# Altium project Relay Controller REV4.PrjPcb
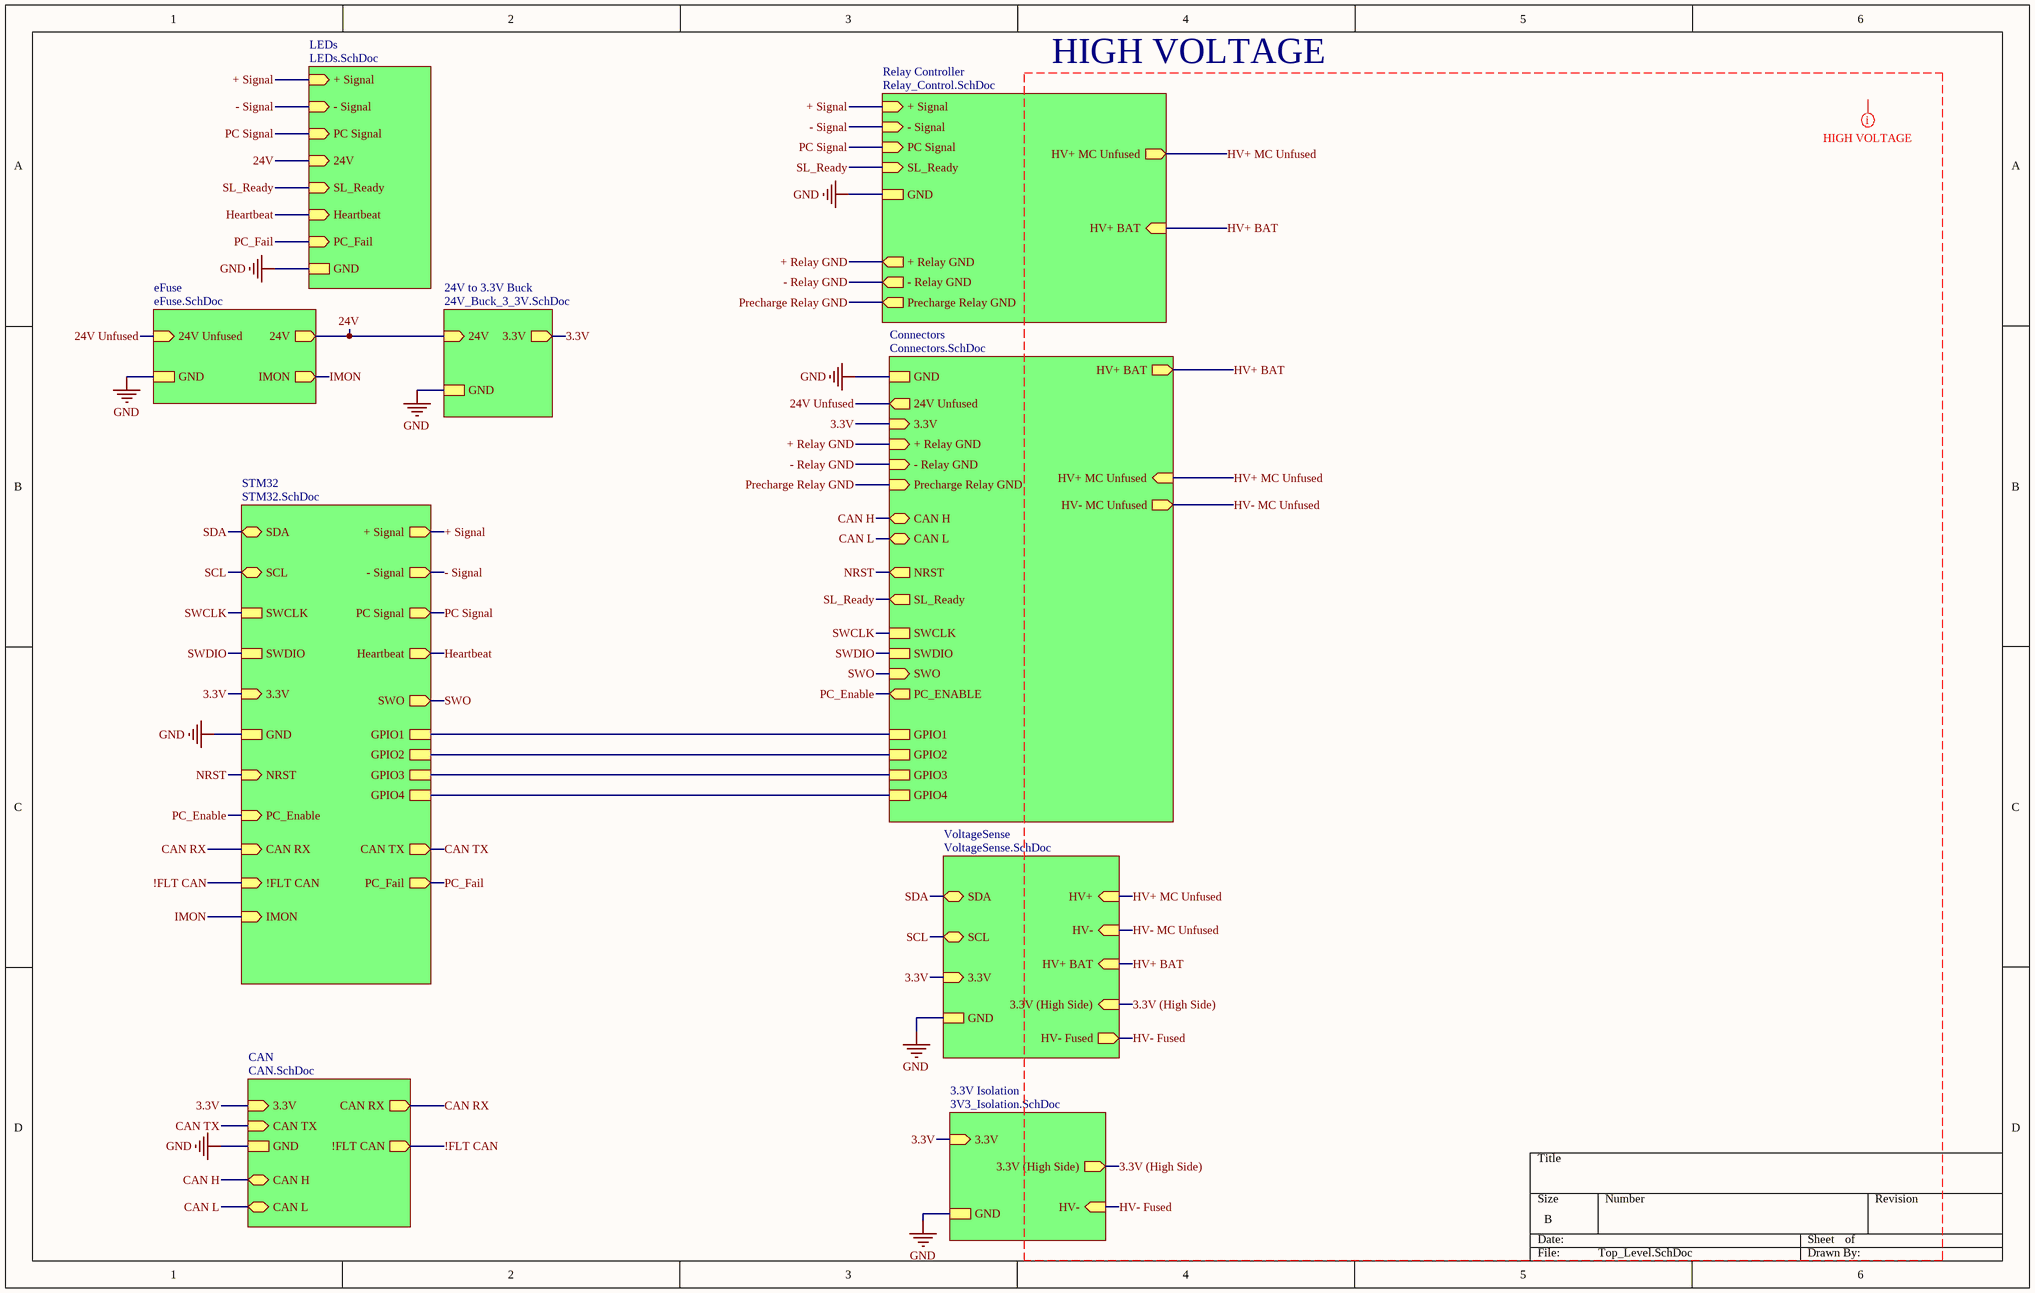
[diagram p0: Top_Level.SchDoc]
11 sheets, 129 parts. Net scope: hierarchical (ports join the sheet entries above them; power ports are global).
Board file: Relay_Controller_REV4.PcbDoc
Sheets:
  Top_Level.SchDoc
    Relay Controller = Relay_Control.SchDoc
    Connectors = Connectors.SchDoc
    LEDs = LEDs.SchDoc
      + = LED_Driver.SchDoc
      - = LED_Driver.SchDoc
      PC = LED_Driver.SchDoc
      HB = LED_Driver.SchDoc
      SLR = LED_Driver.SchDoc
      PC_Fail = Precharge_Fail.SchDoc
    STM32 = STM32.SchDoc
    VoltageSense = VoltageSense.SchDoc
    eFuse = eFuse.SchDoc
    24V to 3.3V Buck = 24V_Buck_3_3V.SchDoc
    CAN = CAN.SchDoc

## Sheet Top_Level.SchDoc
size B; SheetNumber: 1; SheetTotal: 10

### Sub-sheets
3.3V Isolation = 3V3_Isolation.SchDoc (file not in this document): GND, 3.3V (in), 3.3V (High Side) (out), HV- (in)
24V to 3.3V Buck = 24V_Buck_3_3V.SchDoc: 24V (in), GND, 3.3V (out)
CAN = CAN.SchDoc: 3.3V (in), GND, CAN RX (out), CAN TX (in), !FLT CAN (out), CAN H (bidir), CAN L (bidir)
Connectors = Connectors.SchDoc: GND, + Relay GND (in), - Relay GND (in), Precharge Relay GND (in), HV+ BAT (out), 24V Unfused (out), HV+ MC Unfused (in), HV- MC Unfused (out), 3.3V (in), SWCLK, SWDIO, SWO (in), NRST (out), GPIO1, GPIO2, GPIO3, GPIO4, PC_ENABLE (out), CAN H (bidir), CAN L (bidir), SL_Ready (out)
eFuse = eFuse.SchDoc: 24V Unfused (in), GND, 24V (out), IMON (out)
LEDs = LEDs.SchDoc: + Signal (in), - Signal (in), PC Signal (in), 24V (in), GND, SL_Ready (in), Heartbeat (in), PC_Fail (in)
Relay Controller = Relay_Control.SchDoc: + Signal (in), - Signal (in), PC Signal (in), SL_Ready (in), GND, + Relay GND (out), - Relay GND (out), Precharge Relay GND (out), HV+ MC Unfused (out), HV+ BAT (in)
STM32 = STM32.SchDoc: SDA (bidir), SCL (bidir), 3.3V (in), + Signal (out), - Signal (out), PC Signal (out), GND, SWCLK, SWDIO, SWO (out), NRST (in), GPIO1, GPIO2, GPIO3, GPIO4, PC_Enable (in), CAN TX (out), CAN RX (in), Heartbeat (out), !FLT CAN (in), IMON (in), PC_Fail (out)
VoltageSense = VoltageSense.SchDoc: HV+ (in), HV- (in), 3.3V (in), SDA (bidir), SCL (bidir), GND, 3.3V (High Side) (in), HV- Fused (out), HV+ BAT (in)

### Nets
GND: sheet Relay Controller/GND, sheet Connectors/GND, sheet LEDs/GND, sheet STM32/GND, sheet VoltageSense/GND, sheet eFuse/GND, sheet 24V to 3.3V Buck/GND, sheet 3.3V Isolation/GND, sheet CAN/GND
3.3V: sheet Connectors/3.3V, sheet STM32/3.3V, sheet VoltageSense/3.3V, sheet 24V to 3.3V Buck/3.3V, sheet 3.3V Isolation/3.3V, sheet CAN/3.3V
3.3V (High Side): sheet VoltageSense/3.3V (High Side), sheet 3.3V Isolation/3.3V (High Side)
24V: sheet LEDs/24V, sheet eFuse/24V, sheet 24V to 3.3V Buck/24V
24V Unfused: sheet Connectors/24V Unfused, sheet eFuse/24V Unfused
!FLT CAN: sheet STM32/!FLT CAN, sheet CAN/!FLT CAN
+ Relay GND: sheet Relay Controller/+ Relay GND, sheet Connectors/+ Relay GND
+ Signal: sheet Relay Controller/+ Signal, sheet LEDs/+ Signal, sheet STM32/+ Signal
- Relay GND: sheet Relay Controller/- Relay GND, sheet Connectors/- Relay GND
- Signal: sheet Relay Controller/- Signal, sheet LEDs/- Signal, sheet STM32/- Signal
CAN H: sheet Connectors/CAN H, sheet CAN/CAN H
CAN L: sheet Connectors/CAN L, sheet CAN/CAN L
CAN RX: sheet STM32/CAN RX, sheet CAN/CAN RX
CAN TX: sheet STM32/CAN TX, sheet CAN/CAN TX
Heartbeat: sheet LEDs/Heartbeat, sheet STM32/Heartbeat
HV+ BAT: sheet Relay Controller/HV+ BAT, sheet Connectors/HV+ BAT, sheet VoltageSense/HV+ BAT
HV+ MC Unfused: sheet Relay Controller/HV+ MC Unfused, sheet Connectors/HV+ MC Unfused, sheet VoltageSense/HV+
HV- Fused: sheet VoltageSense/HV- Fused, sheet 3.3V Isolation/HV-  [project net HV-]
HV- MC Unfused: sheet Connectors/HV- MC Unfused, sheet VoltageSense/HV-
IMON: sheet STM32/IMON, sheet eFuse/IMON
NRST: sheet Connectors/NRST, sheet STM32/NRST
PC Signal: sheet Relay Controller/PC Signal, sheet LEDs/PC Signal, sheet STM32/PC Signal
PC_Enable: sheet Connectors/PC_ENABLE, sheet STM32/PC_Enable
PC_Fail: sheet LEDs/PC_Fail, sheet STM32/PC_Fail
Precharge Relay GND: sheet Relay Controller/Precharge Relay GND, sheet Connectors/Precharge Relay GND
SCL: sheet STM32/SCL, sheet VoltageSense/SCL
SDA: sheet STM32/SDA, sheet VoltageSense/SDA
SL_Ready: sheet Relay Controller/SL_Ready, sheet Connectors/SL_Ready, sheet LEDs/SL_Ready
SWCLK: sheet Connectors/SWCLK, sheet STM32/SWCLK
SWDIO: sheet Connectors/SWDIO, sheet STM32/SWDIO
SWO: sheet Connectors/SWO, sheet STM32/SWO
NetIC3_21: sheet Connectors/GPIO1, sheet STM32/GPIO1
NetIC3_23: sheet Connectors/GPIO2, sheet STM32/GPIO2
NetIC3_25: sheet Connectors/GPIO3, sheet STM32/GPIO3
NetIC3_27: sheet Connectors/GPIO4, sheet STM32/GPIO4

### Layout directives
mark named HIGH VOLTAGE: 3.3V (High Side), HV+ BAT, HV+ MC Unfused, HV- Fused, HV- MC Unfused

### Notes on the sheet
- HIGH VOLTAGE

## Sheet Relay_Control.SchDoc
size A; SheetNumber: 4; SheetTotal: 10
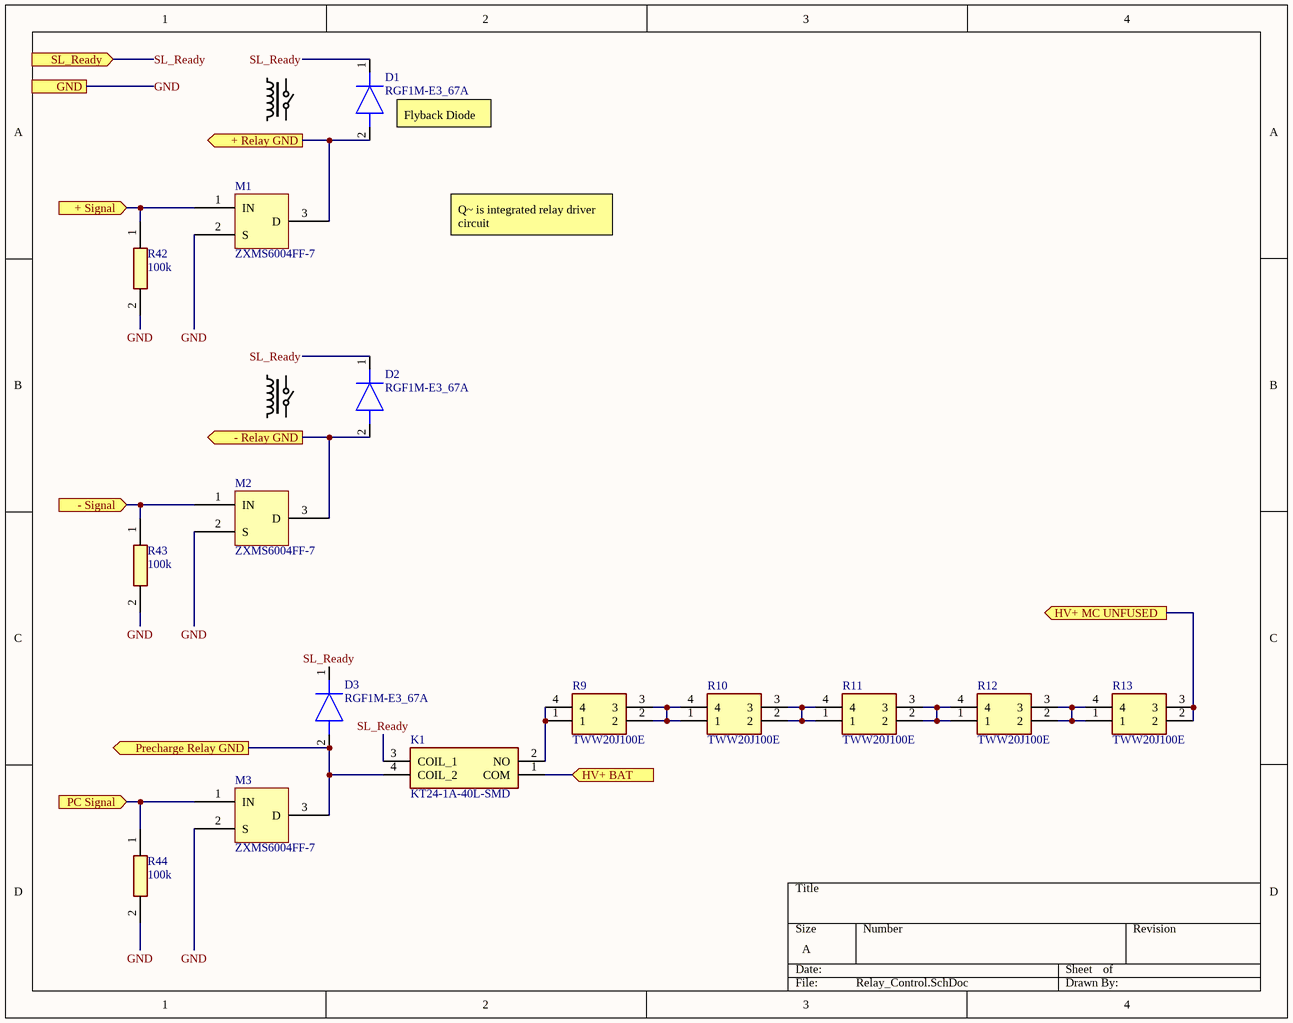
[diagram p1: Relay_Control.SchDoc]

### Parts
D1  RGF1M-E3_67A  [DIOM5426X300N]
D2  RGF1M-E3_67A  [DIOM5426X300N]
D3  RGF1M-E3_67A  [DIOM5426X300N]
K1  KT24-1A-40L-SMD  [KT241A40LSMD]
M1  ZXMS6004FF-7  [SOT95P240X100-3N]
M2  ZXMS6004FF-7  [SOT95P240X100-3N]
M3  ZXMS6004FF-7  [SOT95P240X100-3N]
R9  TWW20J100E  [TWW20J100E]
R10  TWW20J100E  [TWW20J100E]
R11  TWW20J100E  [TWW20J100E]
R12  TWW20J100E  [TWW20J100E]
R13  TWW20J100E  [TWW20J100E]
R42  100k  [RESC3216X65N]
R43  100k  [RESC3216X65N]
R44  100k  [RESC3216X65N]

### Ports
+ Relay GND (out), + Signal (in), - Relay GND (out), - Signal (in), GND, HV+ BAT (in), HV+ MC UNFUSED (out), PC Signal (in), Precharge Relay GND (out), SL_Ready (in)

### Nets
GND: M1.2(S) M2.2(S) M3.2(S) R42.2 R43.2 R44.2 ; port GND
+ Relay GND: D1.2(A) M1.3(D) ; port + Relay GND
+ Signal: M1.1(IN) R42.1 ; port + Signal
- Relay GND: D2.2(A) M2.3(D) ; port - Relay GND
- Signal: M2.1(IN) R43.1 ; port - Signal
HV+ BAT: K1.1(COM) ; port HV+ BAT
HV+ MC Unfused: R13.2 R13.3 ; port HV+ MC UNFUSED
PC Signal: M3.1(IN) R44.1 ; port PC Signal
Precharge Relay GND: D3.2(A) K1.4(COIL_2) M3.3(D) ; port Precharge Relay GND
SL_Ready: D1.1(K) D2.1(K) D3.1(K) K1.3(COIL_1) ; port SL_Ready
NetK1_2: K1.2(NO) R9.1 R9.4
NetR9_2: R9.2 R9.3 R10.1 R10.4
NetR10_2: R10.2 R10.3 R11.1 R11.4
NetR11_2: R11.2 R11.3 R12.1 R12.4
NetR12_2: R12.2 R12.3 R13.1 R13.4

### Notes on the sheet
- (near D1) Flyback Diode
- Q~ is integrated relay driver circuit

### Library data of the parts
D1-D3 = RGF1M-E3_67A: Diode; Manufacturer_Name: Vishay; Manufacturer_Part_Number: RGF1M-E3/67A; Datasheet Link: https://www.vishay.com/docs/88697/rgf1.pdf; Height: 3mm; Mouser Part Number: 625-RGF1M-E3; Mouser Price/Stock: https://www.mouser.co.uk/ProductDetail/Vishay-General-Semiconductor/RGF1M-E3-67A?qs=4xyK702%2F%252BQ1dl%252BTCdyIThg%3D%3D; Arrow Part Number: RGF1M-E3/67A; Arrow Price/Stock: https://www.arrow.com/en/products/rgf1m-e367a/vishay?region=nac
K1 = KT24-1A-40L-SMD: Relay or Contactor; Manufacturer_Name: Meder; Datasheet Link: https://www.mouser.de/datasheet/2/262/9024185401e-1633625.pdf; Height: 8.7mm; Manufacturer_Part_Number: KT24-1A-40L-SMD; Mouser Part Number: 876-KT24-1A-40L-SMD; Mouser Price/Stock: https://www.mouser.co.uk/ProductDetail/MEDER-electronic-Standex/KT24-1A-40L-SMD?qs=mUCnLpxNPte72XvEBELL9g%3D%3D
R9-R13 = TWW20J100E: Resistor; Manufacturer_Name: Ohmite; Datasheet Link: https://www.mouser.in/datasheet/2/303/res_tww_twm-1228653.pdf; Height: 46mm; Manufacturer_Part_Number: TWW20J100E; Mouser Part Number: 588-TWW20J100E; Mouser Price/Stock: https://www.mouser.co.uk/ProductDetail/Ohmite/TWW20J100E?qs=PzGy0jfpSMsE3rbWfgqD2A%3D%3D
R42-R44 = MCA1206ME1003BP500: Resistor; Manufacturer_Name: Vishay; Datasheet Link: https://www.vishay.com/docs/28700/mcx0x0xpre.pdf; Height: 0.65mm; Manufacturer_Part_Number: MCA1206ME1003BP500

## Sheet Connectors.SchDoc
size A; SheetNumber: 8; SheetTotal: 10
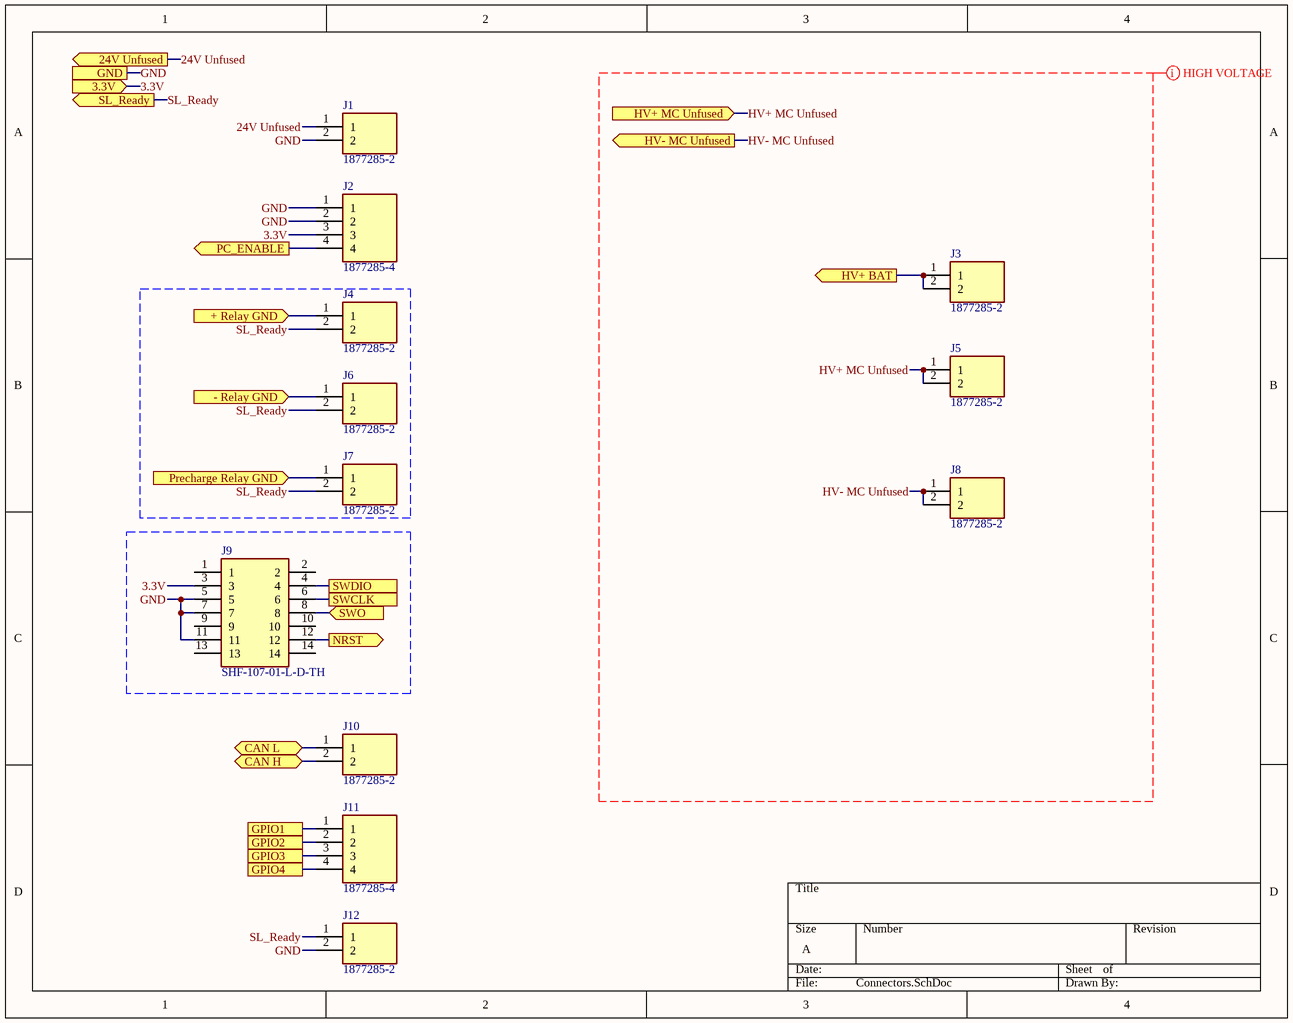
[diagram p2: Connectors.SchDoc]

### Parts
J1  1877285-2  [18772852]
J2  1877285-4  [18772854]
J3  1877285-2  [18772852]
J4  1877285-2  [18772852]
J5  1877285-2  [18772852]
J6  1877285-2  [18772852]
J7  1877285-2  [18772852]
J8  1877285-2  [18772852]
J9  SHF-107-01-L-D-TH  [SHF10701LDTH]
J10  1877285-2  [18772852]
J11  1877285-4  [18772854]
J12  1877285-2  [18772852]

### Ports
3.3V (in), 24V Unfused (out), + Relay GND (in), - Relay GND (in), CAN H (bidir), CAN L (bidir), GND, GPIO1, GPIO2, GPIO3, GPIO4, HV+ BAT (out), HV+ MC Unfused (in), HV- MC Unfused (out), NRST (out), PC_ENABLE (out), Precharge Relay GND (in), SL_Ready (out), SWCLK, SWDIO, SWO (in)

### Nets
GND: J1.2 J2.1 J2.2 J9.5 J9.7 J9.11 J12.2 ; port GND
3.3V: J2.3 J9.3 ; port 3.3V
24V Unfused: J1.1 ; port 24V Unfused
+ Relay GND: J4.1 ; port + Relay GND
- Relay GND: J6.1 ; port - Relay GND
CAN H: J10.2 ; port CAN H
CAN L: J10.1 ; port CAN L
HV+ BAT: J3.1 J3.2 ; port HV+ BAT
HV+ MC Unfused: J5.1 J5.2 ; port HV+ MC Unfused
HV- MC Unfused: J8.1 J8.2 ; port HV- MC Unfused
NRST: J9.12 ; port NRST
PC_Enable: J2.4 ; port PC_ENABLE
Precharge Relay GND: J7.1 ; port Precharge Relay GND
SL_Ready: J4.2 J6.2 J7.2 J12.1 ; port SL_Ready
SWCLK: J9.6 ; port SWCLK
SWDIO: J9.4 ; port SWDIO
SWO: J9.8 ; port SWO
NetIC3_21: J11.1 ; port GPIO1
NetIC3_23: J11.2 ; port GPIO2
NetIC3_25: J11.3 ; port GPIO3
NetIC3_27: J11.4 ; port GPIO4

Not connected (* = marked no-connect by the designer): J9 1 2 9 10 13 14

### Layout directives
mark named HIGH VOLTAGE: HV+ MC Unfused, HV- MC Unfused

### Library data of the parts
J1 J3-J8 J10 J12 = 1877285-2: Connector; Manufacturer_Name: TE Connectivity; Datasheet Link: https://www.te.com/commerce/DocumentDelivery/DDEController?Action=srchrtrv&DocNm=7-1773458-5_ECONOMY_POWER_QRG&DocType=Data%20Sheet&DocLang=English&PartCntxt=1877285-2&DocFormat=pdf; Height: 12mm; Manufacturer_Part_Number: 1877285-2; Mouser Part Number: 571-1877285-2; Mouser Price/Stock: https://www.mouser.co.uk/ProductDetail/TE-Connectivity/1877285-2?qs=ka3zfMQDmFlAIZq5pDt5JA%3D%3D; Arrow Part Number: 1877285-2; Arrow Price/Stock: https://www.arrow.com/en/products/1877285-2/te-connectivity?region=europe
J2 J11 = 1877285-4: Connector; Manufacturer_Name: TE Connectivity; Datasheet Link: https://www.te.com/commerce/DocumentDelivery/DDEController?Action=srchrtrv&DocNm=1877285&DocType=Customer%20Drawing&DocLang=English&PartCntxt=1877285-4&DocFormat=pdf; Height: 12.5mm; Manufacturer_Part_Number: 1877285-4; Mouser Part Number: 571-1877285-4; Mouser Price/Stock: https://www.mouser.co.uk/ProductDetail/TE-Connectivity/1877285-4?qs=ka3zfMQDmFkZPBtotDIXvQ%3D%3D; Arrow Part Number: 1877285-4; Arrow Price/Stock: https://www.arrow.com/en/products/1877285-4/te-connectivity?region=nac
J9 = SHF-107-01-L-D-TH: Connector; Manufacturer_Name: SAMTEC; Datasheet Link: https://componentsearchengine.com/Datasheets/1/SHF-107-01-L-D-TH.pdf; Height: 5.33mm; Manufacturer_Part_Number: SHF-107-01-L-D-TH; Mouser Part Number: 200-SHF10701LDTH; Mouser Price/Stock: https://www.mouser.co.uk/ProductDetail/Samtec/SHF-107-01-L-D-TH?qs=%252BZP6%2F%252BtExtDrbekpOnhfag%3D%3D; Arrow Part Number: SHF-107-01-L-D-TH; Arrow Price/Stock: https://www.arrow.com/en/products/shf-107-01-l-d-th/samtec?utm_currency=USD&region=nac

## Sheet LEDs.SchDoc
size A; SheetNumber: 5; SheetTotal: 10
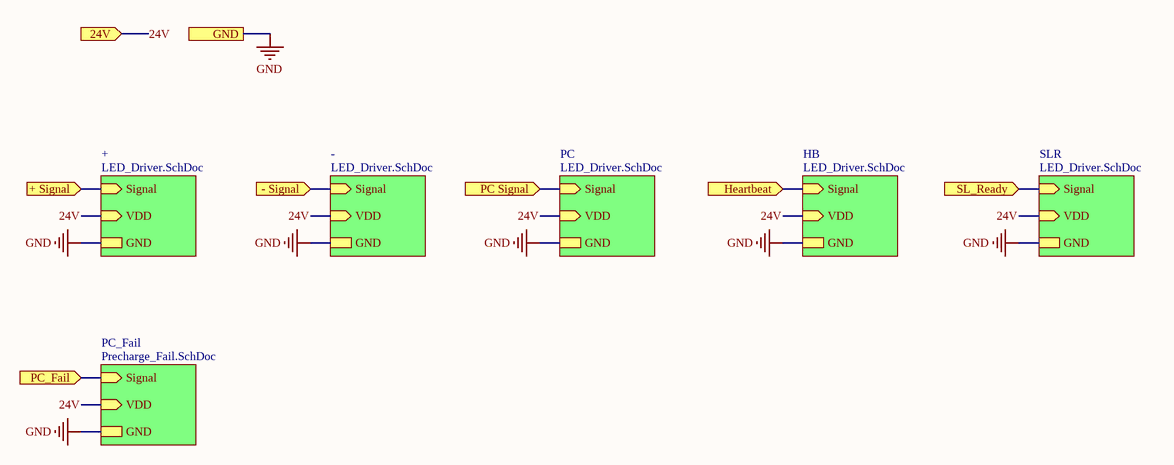
[diagram p3: LEDs.SchDoc]

### Sub-sheets
+ = LED_Driver.SchDoc: Signal (in), VDD (in), GND
- = LED_Driver.SchDoc: Signal (in), VDD (in), GND
HB = LED_Driver.SchDoc: Signal (in), VDD (in), GND
PC = LED_Driver.SchDoc: Signal (in), VDD (in), GND
PC_Fail = Precharge_Fail.SchDoc: Signal (in), VDD (in), GND
SLR = LED_Driver.SchDoc: Signal (in), VDD (in), GND

### Ports
24V (in), + Signal (in), - Signal (in), GND, Heartbeat (in), PC Signal (in), PC_Fail (in), SL_Ready (in)

### Nets
GND: port GND, sheet +/GND, sheet -/GND, sheet PC/GND, sheet HB/GND, sheet SLR/GND, sheet PC_Fail/GND
24V: port 24V, sheet +/VDD, sheet -/VDD, sheet PC/VDD, sheet HB/VDD, sheet SLR/VDD, sheet PC_Fail/VDD
+ Signal: port + Signal, sheet +/Signal
- Signal: port - Signal, sheet -/Signal
Heartbeat: port Heartbeat, sheet HB/Signal
PC Signal: port PC Signal, sheet PC/Signal
PC_Fail: port PC_Fail, sheet PC_Fail/Signal
SL_Ready: port SL_Ready, sheet SLR/Signal

## Sheet LED_Driver.SchDoc
size A; SheetNumber: 6; SheetTotal: 10
Used 5 times, as channels LEDs/+, LEDs/-, LEDs/PC, LEDs/HB, LEDs/SLR. Parts and nets are listed once, with the designators drawn on the sheet.
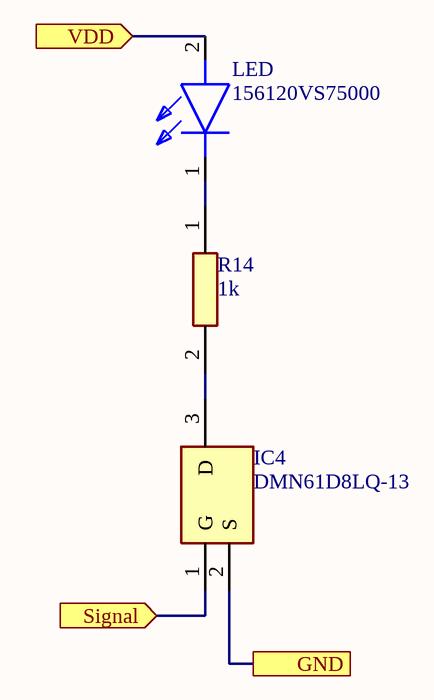
[diagram p4: LED_Driver.SchDoc]

### Parts
IC4  DMN61D8LQ-13  [SOT96P240X110-3N]
LED  156120VS75000  [156120VS75000]
R14  1k  [RESC3116X65N]

### Ports
GND, Signal (in), VDD (in)

### Nets
GND: IC4.2(S) ; port GND
Signal: IC4.1(G) ; port Signal
VDD: LED.2(A) ; port VDD
NetIC4_3: IC4.3(D) R14.2
NetLED_1: LED.1(K) R14.1

### Channels
LEDs/+: designators end in _+; ports GND=GND Signal=+ Signal VDD=24V
LEDs/-: designators end in _-; ports GND=GND Signal=- Signal VDD=24V
LEDs/PC: designators end in _PC; ports GND=GND Signal=PC Signal VDD=24V
LEDs/HB: designators end in _HB; ports GND=GND Signal=Heartbeat VDD=24V
LEDs/SLR: designators end in _SLR; ports GND=GND Signal=SL_Ready VDD=24V

### Library data of the parts
IC4 = DMN61D8LQ-13: Integrated Circuit; Manufacturer_Name: Diodes Incorporated; Datasheet Link: https://www.diodes.com//assets/Datasheets/DMN61D8LQ.pdf; Height: 1.1mm; Manufacturer_Part_Number: DMN61D8LQ-13; Mouser Part Number: 621-DMN61D8LQ-13; Mouser Price/Stock: https://www.mouser.co.uk/ProductDetail/Diodes-Incorporated/DMN61D8LQ-13?qs=DBvH5xl4UymJgoulTjiNCg%3D%3D; Arrow Part Number: DMN61D8LQ-13; Arrow Price/Stock: https://www.arrow.com/en/products/dmn61d8lq-13/diodes-incorporated?utm_currency=USD&region=nac
LED = 156120VS75000: LED; Manufacturer_Name: Wurth Elektronik; Datasheet Link: https://www.we-online.com/components/products/datasheet/156120VS75000.pdf; Height: 1.3mm; Manufacturer_Part_Number: 156120VS75000; Mouser Part Number: 710-156120VS75000; Mouser Price/Stock: https://www.mouser.co.uk/ProductDetail/Wurth-Elektronik/156120VS75000?qs=2kOmHSv6VfQAUFg5BeuEfQ%3D%3D
R14 = CRGS1206J1K0: Resistor; Manufacturer_Name: TE Connectivity; Datasheet Link: https://www.te.com/commerce/DocumentDelivery/DDEController?Action=srchrtrv&DocNm=9-1773463-8&DocType=Data%20Sheet&DocLang=English&PartCntxt=3-2176245-7&DocFormat=pdf; Height: 0.65mm; Manufacturer_Part_Number: CRGS1206J1K0; Mouser Part Number: 279-CRGS1206J1K0; Mouser Price/Stock: https://www.mouser.com/Search/Refine.aspx?Keyword=279-CRGS1206J1K0

## Sheet Precharge_Fail.SchDoc
size A
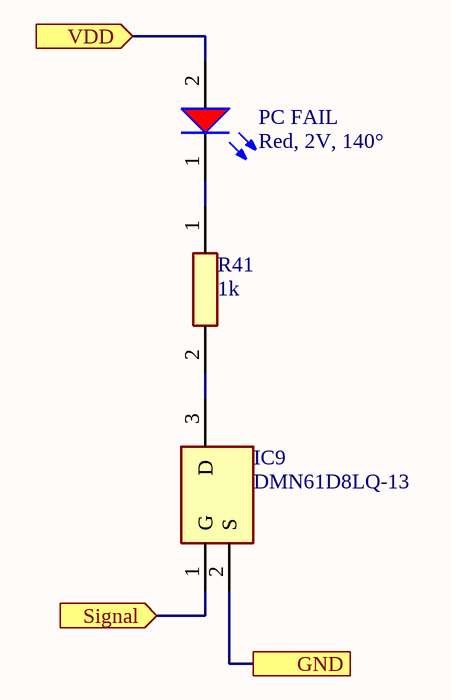
[diagram p5: Precharge_Fail.SchDoc]

### Parts
IC9  DMN61D8LQ-13  [SOT96P240X110-3N]
PC_FAIL  Red, 2V, 140°  [WL-SMRW_1206 rectangular_normal use]
R41  1k  [RESC3116X65N]

### Ports
GND, Signal (in), VDD (in)

### Nets
GND: IC9.2(S) ; port GND
24V: PC_FAIL.2(A) ; port VDD
PC_Fail: IC9.1(G) ; port Signal
NetIC9_3: IC9.3(D) R41.2
NetPC_FAIL_1: PC_FAIL.1(K) R41.1

### Library data of the parts
IC9 = DMN61D8LQ-13: as IC4 on sheet LED_Driver; Datasheet Link: https://www.diodes.com//assets/Datasheets/DMN61D8LQ.pdf; Height: 1.1mm; Manufacturer_Part_Number: DMN61D8LQ-13; Mouser Part Number: 621-DMN61D8LQ-13; Mouser Price/Stock: https://www.mouser.co.uk/ProductDetail/Diodes-Incorporated/DMN61D8LQ-13?qs=DBvH5xl4UymJgoulTjiNCg%3D%3D; Arrow Part Number: DMN61D8LQ-13; Arrow Price/Stock: https://www.arrow.com/en/products/dmn61d8lq-13/diodes-incorporated?utm_currency=USD&region=nac
PC_FAIL = 156120RS75000: WL-SMRW Mono-color Reverse mount Waterclear, SMT, size 1206 rectangular, Red, 2V, 140°; Manufacturer: Wurth Elektronik; Chip Technology: AlInGaP; Dominant Wavelength: 624nm; Luminous Intensity: 60mcd; Peak Wavelength: 632nm; Manufacturer Part Number: 156120RS75000; Category: Signal LEDs; Match Code: WL-SMRW; ComponentLink1Description: Website Link; ComponentLink1URL: https://www.we-online.com/redexpert/article/156120RS75000?ad; ComponentLink2Description: Datasheet Link; ComponentLink2URL: https://www.we-online.com/redexpert/spec/156120RS75000?ad; Mount: Surface Mount; Operating Temperature Max: 85°C; Operating Temperature Min: -40°C; Packaging: Tape and Reel; Case/Size Code: 1206 rectangular; Length: 3.2mm; Width: 1.6mm; Height: 1.2mm; Emitting Color: Red; Forward Voltage: 2V; Viewing Angle: 140°
R41 = CRGS1206J1K0: as R14 on sheet LED_Driver; Datasheet Link: https://www.te.com/commerce/DocumentDelivery/DDEController?Action=srchrtrv&DocNm=9-1773463-8&DocType=Data%20Sheet&DocLang=English&PartCntxt=3-2176245-7&DocFormat=pdf; Height: 0.65mm; Manufacturer_Part_Number: CRGS1206J1K0; Mouser Part Number: 279-CRGS1206J1K0; Mouser Price/Stock: https://www.mouser.com/Search/Refine.aspx?Keyword=279-CRGS1206J1K0

## Sheet STM32.SchDoc
size A; SheetNumber: 3; SheetTotal: 10
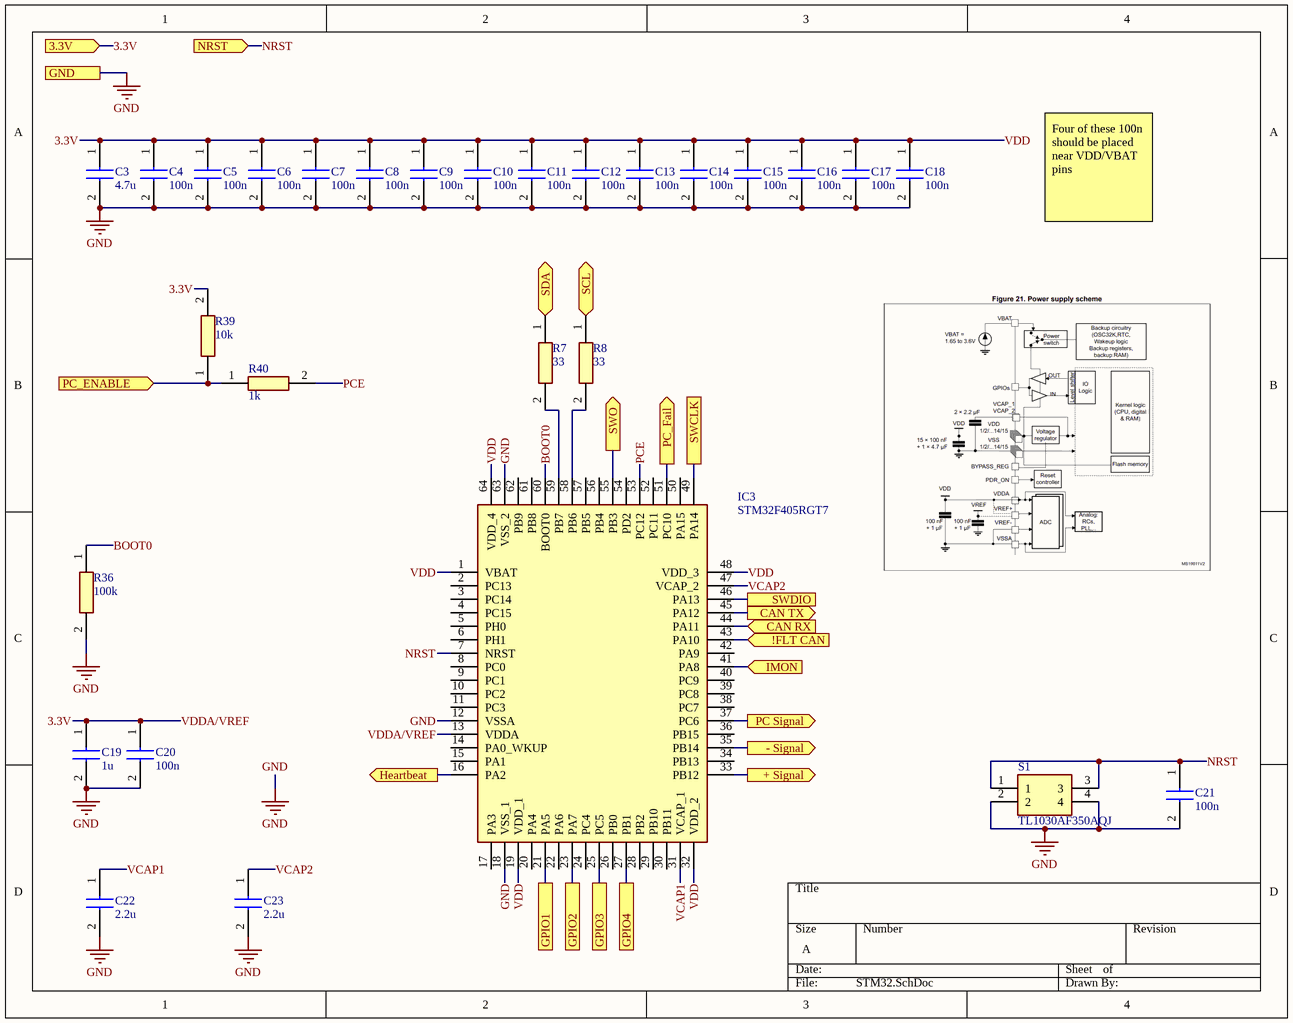
[diagram p6: STM32.SchDoc]

### Parts
C3  4.7u  [CAPC3216X180N]
C4  100n  [CAPC3216X94N]
C5  100n  [CAPC3216X94N]
C6  100n  [CAPC3216X94N]
C7  100n  [CAPC3216X94N]
C8  100n  [CAPC3216X94N]
C9  100n  [CAPC3216X94N]
C10  100n  [CAPC3216X94N]
C11  100n  [CAPC3216X94N]
C12  100n  [CAPC3216X94N]
C13  100n  [CAPC3216X94N]
C14  100n  [CAPC3216X94N]
C15  100n  [CAPC3216X94N]
C16  100n  [CAPC3216X94N]
C17  100n  [CAPC3216X94N]
C18  100n  [CAPC3216X94N]
C19  1u  [CAPC3216X180N]
C20  100n  [CAPC3216X94N]
C21  100n  [CAPC3216X94N]
C22  2.2u  [CAPC3216X180N]
C23  2.2u  [CAPC3216X180N]
IC3  STM32F405RGT7  [QFP50P1200X1200X160-64N]
R7  33  [ERJ8ENF1000V]
R8  33  [ERJ8ENF1000V]
R36  100k  [RESC3216X65N]
R39  10k  [RESC3216X65N]
R40  1k  [RESC3116X65N]
S1  TL1030AF350AQJ  [TL1030AF350AQJ]

### Ports
3.3V (in), !FLT CAN (in), + Signal (out), - Signal (out), CAN RX (in), CAN TX (out), GND, GPIO1, GPIO2, GPIO3, GPIO4, Heartbeat (out), IMON (in), NRST (in), PC Signal (out), PC_ENABLE (in), PC_Fail (out), SCL (bidir), SDA (bidir), SWCLK, SWDIO, SWO (out)

### Nets
GND: C3.2 C4.2 C5.2 C6.2 C7.2 C8.2 C9.2 C10.2 C11.2 C12.2 C13.2 C14.2 C15.2 C16.2 C17.2 C18.2 C19.2 C20.2 C21.2 C22.2 C23.2 IC3.12(VSSA) IC3.18(VSS_1) IC3.63(VSS_2) R36.2 S1.2 S1.4 ; port GND
3.3V: C3.1 C4.1 C5.1 C6.1 C7.1 C8.1 C9.1 C10.1 C11.1 C12.1 C13.1 C14.1 C15.1 C16.1 C17.1 C18.1 C19.1 C20.1 IC3.1(VBAT) IC3.13(VDDA) IC3.19(VDD_1) IC3.32(VDD_2) IC3.48(VDD_3) IC3.64(VDD_4) R39.2 ; port 3.3V  [also labelled VDD, VDDA/VREF]
!FLT CAN: IC3.43(PA10) ; port !FLT CAN
+ Signal: IC3.33(PB12) ; port + Signal
- Signal: IC3.35(PB14) ; port - Signal
BOOT0: IC3.60(BOOT0) R36.1
CAN RX: IC3.44(PA11) ; port CAN RX
CAN TX: IC3.45(PA12) ; port CAN TX
Heartbeat: IC3.16(PA2) ; port Heartbeat
IMON: IC3.41(PA8) ; port IMON
NRST: C21.1 IC3.7(NRST) S1.1 S1.3 ; port NRST
PC Signal: IC3.37(PC6) ; port PC Signal
PC_Enable: R39.1 R40.1 ; port PC_ENABLE
PC_Fail: IC3.51(PC10) ; port PC_Fail
PCE: IC3.53(PC12) R40.2
SCL: R8.1 ; port SCL
SDA: R7.1 ; port SDA
SWCLK: IC3.49(PA14) ; port SWCLK
SWDIO: IC3.46(PA13) ; port SWDIO
SWO: IC3.55(PB3) ; port SWO
VCAP1: C22.1 IC3.31(VCAP_1)
VCAP2: C23.1 IC3.47(VCAP_2)
NetIC3_21: IC3.21(PA5) ; port GPIO1
NetIC3_23: IC3.23(PA7) ; port GPIO2
NetIC3_25: IC3.25(PC5) ; port GPIO3
NetIC3_27: IC3.27(PB1) ; port GPIO4
NetIC3_58: IC3.58(PB6) R8.2
NetIC3_59: IC3.59(PB7) R7.2

Not connected (* = marked no-connect by the designer): IC3 2(PC13) 3(PC14) 4(PC15) 5(PH0) 6(PH1) 8(PC0) 9(PC1) 10(PC2) 11(PC3) 14(PA0_WKUP) 15(PA1) 17(PA3) 20(PA4) 22(PA6) 24(PC4) 26(PB0) 28(PB2) 29(PB10) 30(PB11) 34(PB13) 36(PB15) 38(PC7) 39(PC8) 40(PC9) 42(PA9) 50(PA15) 52(PC11) 54(PD2) 56(PB4) 57(PB5) 61(PB8) 62(PB9)

### Notes on the sheet
- Four of these 100n should be placed near VDD/VBAT pins

### Library data of the parts
C3 = GMK316AB7475KLHT: Capacitor; Manufacturer_Name: TAIYO YUDEN; Datasheet Link: https://ds.yuden.co.jp/TYCOMPAS/ap/specSheet?pn=MMASG31LAB7475KTNA01; Height: 1.8mm; Manufacturer_Part_Number: GMK316AB7475KLHT; Mouser Part Number: 963-GMK316AB7475KLHT; Mouser Price/Stock: https://www.mouser.co.uk/ProductDetail/TAIYO-YUDEN/GMK316AB7475KLHT?qs=CNQs48zzdnoeKLJ9%2F6WNWQ%3D%3D; Arrow Part Number: GMK316AB7475KLHT; Arrow Price/Stock: https://www.arrow.com/en/products/gmk316ab7475klht/taiyo-yuden?utm_currency=USD&region=nac
C4-C18 C20 C21 = 12065C104J4Z2A: Capacitor; Manufacturer_Name: Kyocera AVX; Datasheet Link: https://spicat.kyocera-avx.com/product/mlcc/chartview/12065C104J4Z2A/DataSheet/X7R; Height: 0.94mm; Manufacturer_Part_Number: 12065C104J4Z2A; Mouser Part Number: 581-12065C104J4Z2A; Mouser Price/Stock: https://www.mouser.com/Search/Refine.aspx?Keyword=581-12065C104J4Z2A
C19 = HMK316B7105KLHT: Capacitor; Manufacturer_Name: TAIYO YUDEN; Datasheet Link: https://mouser.componentsearchengine.com/Datasheets/1/HMK316B7105KLHT.pdf; Height: 1.8mm; Manufacturer_Part_Number: HMK316B7105KLHT; Mouser Part Number: 963-HMK316B7105KLHT; Mouser Price/Stock: https://www.mouser.co.uk/ProductDetail/TAIYO-YUDEN/HMK316B7105KLHT?qs=sz8xDBnIhcFmvpGfTAF0nQ%3D%3D; Arrow Part Number: HMK316B7105KLHT; Arrow Price/Stock: null?utm_currency=USD&region=nac
C22 C23 = CL31B225KCHSNNE: Capacitor; Manufacturer_Name: SAMSUNG; Datasheet Link: https://ms.componentsearchengine.com/Datasheets/2/CL31B225KCHSNNE.pdf; Height: 1.8mm; Manufacturer_Part_Number: CL31B225KCHSNNE; Mouser Part Number: 187-CL31B225KCHSNNE; Mouser Price/Stock: https://www.mouser.co.uk/ProductDetail/Samsung-Electro-Mechanics/CL31B225KCHSNNE?qs=EqekMjxHB%2FO4jGlN37Y2aA%3D%3D; Arrow Part Number: CL31B225KCHSNNE; Arrow Price/Stock: https://www.arrow.com/en/products/cl31b225kchsnne/samsung-electro-mechanics?utm_currency=USD&region=nac
IC3 = STM32F405RGT7: Integrated Circuit; Manufacturer_Name: STMicroelectronics; Datasheet Link: https://www.st.com/content/ccc/resource/technical/document/datasheet/ef/92/76/6d/bb/c2/4f/f7/DM00037051.pdf/files/DM00037051.pdf/jcr:content/translations/en.DM00037051.pdf; Height: 1.6mm; Manufacturer_Part_Number: STM32F405RGT7; Mouser Part Number: 511-STM32F405RGT7; Mouser Price/Stock: https://www.mouser.co.uk/ProductDetail/STMicroelectronics/STM32F405RGT7?qs=DqCdCwOw4%2F6rAq3yUvY8rA%3D%3D; Arrow Part Number: STM32F405RGT7; Arrow Price/Stock: https://www.arrow.com/en/products/stm32f405rgt7/stmicroelectronics?utm_currency=USD&region=nac
R7 R8 = ERJ-8ENF33R0V: Resistor; Manufacturer_Name: Panasonic; Datasheet Link: https://industrial.panasonic.com/cdbs/www-data/pdf/RDA0000/AOA0000C86.pdf; Height: 0.7mm; Manufacturer_Part_Number: ERJ-8ENF33R0V; Mouser Part Number: 667-ERJ-8ENF33R0V; Mouser Price/Stock: https://www.mouser.co.uk/ProductDetail/Panasonic/ERJ-8ENF33R0V?qs=8%252BG0TiN%2FgVpb1yH%2F8k6uQg%3D%3D
R36 = MCA1206ME1003BP500: Resistor; Manufacturer_Name: Vishay; Datasheet Link: https://www.vishay.com/docs/28700/mcx0x0xpre.pdf; Height: 0.65mm; Manufacturer_Part_Number: MCA1206ME1003BP500
R39 = SFR18EZPJ103: Resistor; Manufacturer_Name: ROHM Semiconductor; Datasheet Link: https://fscdn.rohm.com/en/products/databook/datasheet/passive/resistor/chip_resistor/sfr-e.pdf; Height: 0.65mm; Manufacturer_Part_Number: SFR18EZPJ103
R40 = CRGS1206J1K0: as R14 on sheet LED_Driver; Datasheet Link: https://www.te.com/commerce/DocumentDelivery/DDEController?Action=srchrtrv&DocNm=9-1773463-8&DocType=Data%20Sheet&DocLang=English&PartCntxt=3-2176245-7&DocFormat=pdf; Height: 0.65mm; Manufacturer_Part_Number: CRGS1206J1K0; Mouser Part Number: 279-CRGS1206J1K0; Mouser Price/Stock: https://www.mouser.com/Search/Refine.aspx?Keyword=279-CRGS1206J1K0
S1 = TL1030AF350AQJ: Switch; Manufacturer_Name: E-Switch; Datasheet Link: https://configured-product-images.s3.amazonaws.com/2D/specs/TL1030AF350AQJ.pdf; Height: 1.95mm; Manufacturer_Part_Number: TL1030AF350AQJ; Mouser Part Number: 612-TL1030AF350AQJ; Mouser Price/Stock: https://www.mouser.co.uk/ProductDetail/E-Switch/TL1030AF350AQJ?qs=VVKQmw408U%2FgalG8VZqjEg%3D%3D

## Sheet VoltageSense.SchDoc
size A; SheetNumber: 2; SheetTotal: 10
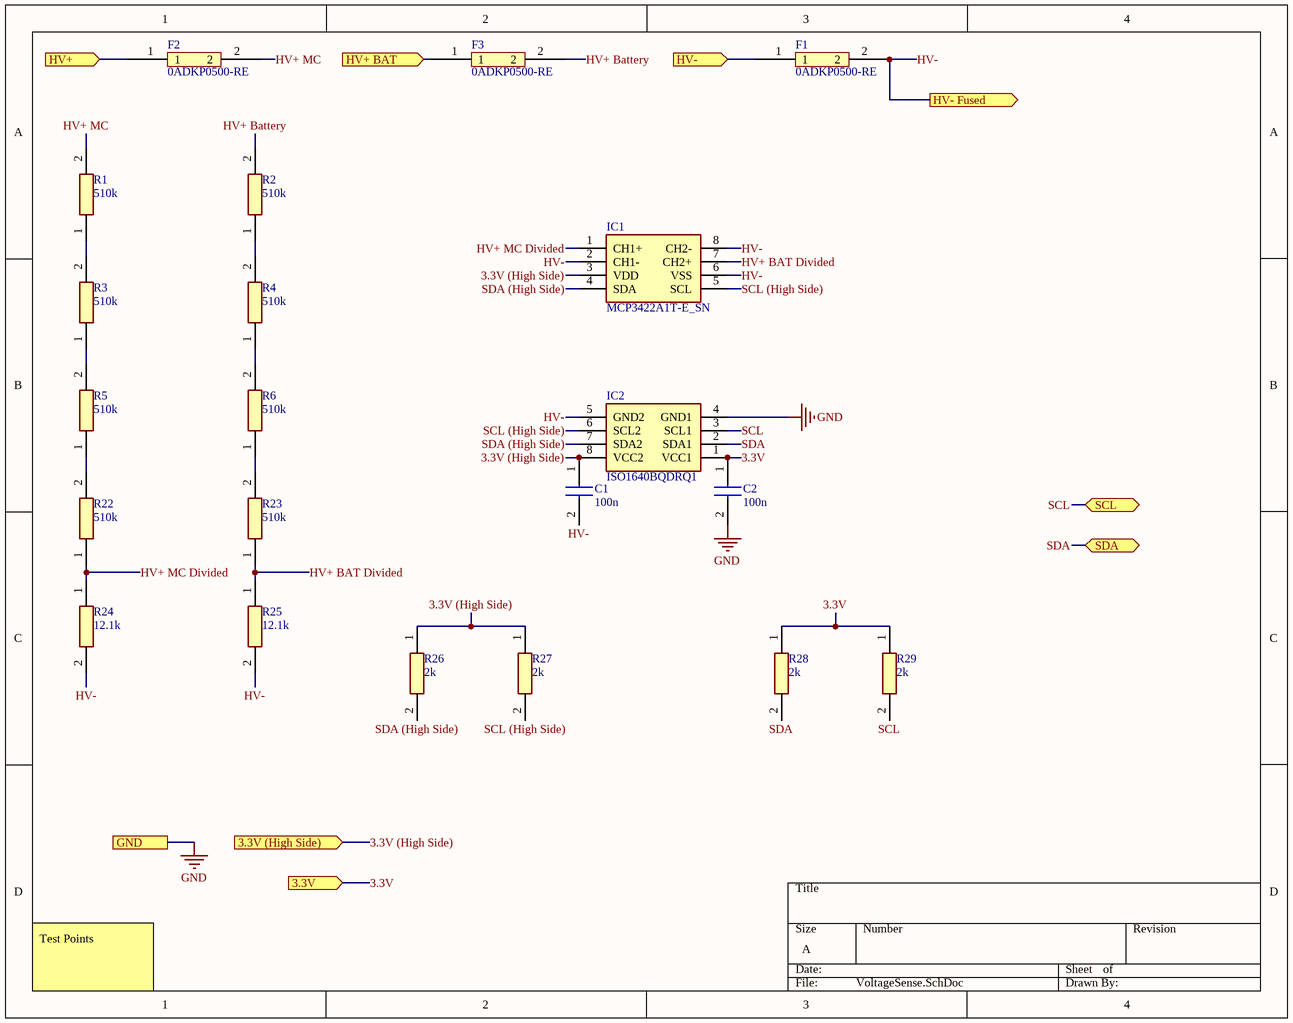
[diagram p7: VoltageSense.SchDoc]

### Parts
C1  100n  [CAPC3216X94N]
C2  100n  [CAPC3216X94N]
F1  0ADKP0500-RE  [0ADKP0500-RE]
F2  0ADKP0500-RE  [0ADKP0500-RE]
F3  0ADKP0500-RE  [0ADKP0500-RE]
IC1  MCP3422A1T-E_SN  [SOIC127P600X175-8N]
IC2  ISO1640BQDRQ1  [SOIC127P600X175-8N]
R1  510k  [RESC3216X75N]
R2  510k  [RESC3216X75N]
R3  510k  [RESC3216X75N]
R4  510k  [RESC3216X75N]
R5  510k  [RESC3216X75N]
R6  510k  [RESC3216X75N]
R22  510k  [RESC3216X75N]
R23  510k  [RESC3216X75N]
R24  12.1k  [ERA6AEB101V]
R25  12.1k  [ERA6AEB101V]
R26  2k  [RESC3116X65N]
R27  2k  [RESC3116X65N]
R28  2k  [RESC3116X65N]
R29  2k  [RESC3116X65N]

### Ports
3.3V (High Side) (in), 3.3V (in), GND, HV+ (in), HV+ BAT (in), HV- (in), HV- Fused (out), SCL (bidir), SDA (bidir)

### Nets
GND: C2.2 IC2.4(GND1) ; port GND
3.3V: C2.1 IC2.1(VCC1) R28.1 R29.1 ; port 3.3V
3.3V (High Side): C1.1 IC1.3(VDD) IC2.8(VCC2) R26.1 R27.1 ; port 3.3V (High Side)
HV+ BAT: F3.1 ; port HV+ BAT
HV+ BAT Divided: IC1.7(CH2+) R23.1 R25.1
HV+ Battery: F3.2 R2.2
HV+ MC: F2.2 R1.2
HV+ MC Divided: IC1.1(CH1+) R22.1 R24.1
HV+ MC Unfused: F2.1 ; port HV+
HV-: C1.2 F1.2 IC1.2(CH1-) IC1.6(VSS) IC1.8(CH2-) IC2.5(GND2) R24.2 R25.2 ; port HV- Fused
HV- MC Unfused: F1.1 ; port HV-
SCL: IC2.3(SCL1) R29.2 ; port SCL
SCL (High Side): IC1.5(SCL) IC2.6(SCL2) R27.2
SDA: IC2.2(SDA1) R28.2 ; port SDA
SDA (High Side): IC1.4(SDA) IC2.7(SDA2) R26.2
NetR1_1: R1.1 R3.2
NetR2_1: R2.1 R4.2
NetR3_1: R3.1 R5.2
NetR4_1: R4.1 R6.2
NetR5_1: R5.1 R22.2
NetR6_1: R6.1 R23.2

### Notes on the sheet
- Test Points

### Library data of the parts
C1 C2 = 12065C104J4Z2A: as C4 on sheet STM32; Datasheet Link: https://spicat.kyocera-avx.com/product/mlcc/chartview/12065C104J4Z2A/DataSheet/X7R; Height: 0.94mm; Manufacturer_Part_Number: 12065C104J4Z2A; Mouser Part Number: 581-12065C104J4Z2A; Mouser Price/Stock: https://www.mouser.com/Search/Refine.aspx?Keyword=581-12065C104J4Z2A
F1-F3 = 0ADKP0500-RE: Fuse
IC1 = MCP3422A1T-E_SN: Integrated Circuit; Manufacturer_Name: Microchip; Manufacturer_Part_Number: MCP3422A1T-E/SN; Datasheet Link: https://ww1.microchip.com/downloads/en/DeviceDoc/22088c.pdf; Height: 1.75mm; Mouser Part Number: 579-MCP3422A1T-E/SN; Mouser Price/Stock: https://www.mouser.co.uk/ProductDetail/Microchip-Technology/MCP3422A1T-E-SN?qs=X98pPdo4MrvBbe3HwfJ%252Bfw%3D%3D; Arrow Part Number: MCP3422A1T-E/SN; Arrow Price/Stock: https://www.arrow.com/en/products/mcp3422a1t-esn/microchip-technology
IC2 = ISO1640BQDRQ1: Integrated Circuit; Manufacturer_Name: Texas Instruments; Datasheet Link: https://www.ti.com/lit/ds/symlink/iso1640.pdf; Height: 1.75mm; Manufacturer_Part_Number: ISO1640BQDRQ1; Mouser Part Number: 595-ISO1640BQDRQ1; Mouser Price/Stock: https://www.mouser.co.uk/ProductDetail/Texas-Instruments/ISO1640BQDRQ1?qs=QNEnbhJQKvat3Z1mRPODGw%3D%3D; Arrow Part Number: ISO1640BQDRQ1; Arrow Price/Stock: https://www.arrow.com/en/products/iso1640bqdrq1/texas-instruments?region=nac
R1-R6 R22 R23 = CR1206-FX-5103ELF: Resistor; Manufacturer_Name: Bourns; Datasheet Link: http://componentsearchengine.com/Datasheets/1/CR1206-FX-5103ELF.pdf; Height: 0.75mm; Manufacturer_Part_Number: CR1206-FX-5103ELF; Mouser Part Number: 652-CR1206FX-5103ELF; Mouser Price/Stock: https://www.mouser.co.uk/ProductDetail/Bourns/CR1206-FX-5103ELF?qs=O4EQhShwvrpqwloF6Ll%2FVg%3D%3D; Arrow Part Number: CR1206-FX-5103ELF; Arrow Price/Stock: https://www.arrow.com/en/products/cr1206-fx-5103elf/bourns?region=europe
R24 R25 = ERA-6AEB1212V: Resistor; Manufacturer_Name: Panasonic; Datasheet Link: https://industrial.panasonic.com/cdbs/www-data/pdf/RDM0000/AOA0000C307.pdf; Height: 0.6mm; Manufacturer_Part_Number: ERA-6AEB1212V; Mouser Part Number: 667-ERA-6AEB1212V; Mouser Price/Stock: https://www.mouser.co.uk/ProductDetail/Panasonic/ERA-6AEB1212V?qs=DyUWGjl%252BcVvcV08sco2Dng%3D%3D
R26-R29 = CHP1206AFX-2001ELF: Resistor; Manufacturer_Name: Bourns; Datasheet Link: https://www.mouser.mx/datasheet/2/54/chp-a-1858677.pdf; Height: 0.65mm; Manufacturer_Part_Number: CHP1206AFX-2001ELF; Mouser Part Number: 652-CHP1206AFX-2001L; Mouser Price/Stock: https://www.mouser.co.uk/ProductDetail/Bourns/CHP1206AFX-2001ELF?qs=GedFDFLaBXERFI3Dnxqg6Q%3D%3D

## Sheet eFuse.SchDoc
size A; SheetNumber: 7; SheetTotal: 10
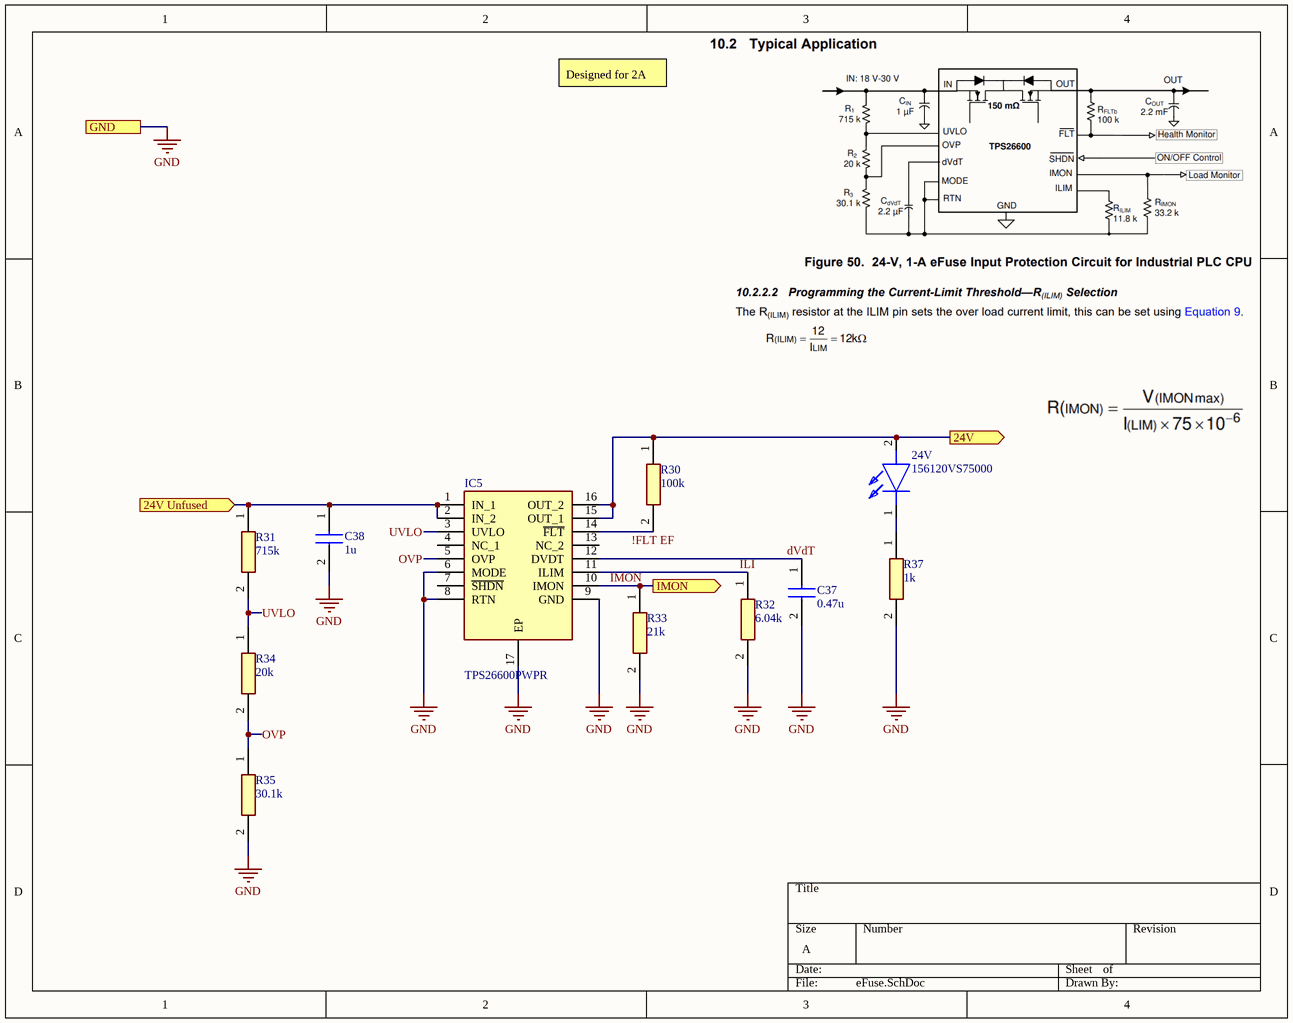
[diagram p8: eFuse.SchDoc]

### Parts
24V  156120VS75000  [156120VS75000]
C37  0.47u  [CAPC3216X152N]
C38  1u  [CAPC3216X178N]
IC5  TPS26600PWPR  [SOP65P640X120-17N]
R30  100k  [RESC3216X65N]
R31  715k  [RESC3216X70N]
R32  6.04k  [RESC3216X70N]
R33  21k  [RESC3216X70N]
R34  20k  [RESC3216X70N]
R35  30.1k  [RESC3216X70N]
R37  1k  [RESC3116X65N]

### Ports
24V (out), 24V Unfused (in), GND, IMON (out)

### Nets
GND: C37.2 C38.2 IC5.6(MODE) IC5.8(RTN) IC5.9(GND) IC5.17(EP) R32.2 R33.2 R35.2 R37.2 ; port GND
24V: 24V.2(A) IC5.15(OUT_1) IC5.16(OUT_2) R30.1 ; port 24V
24V Unfused: C38.1 IC5.1(IN_1) IC5.2(IN_2) R31.1 ; port 24V Unfused
!FLT EF: IC5.14(~{FLT}) R30.2
dVdT: C37.1 IC5.12(DVDT)
ILI: IC5.11(ILIM) R32.1
IMON: IC5.10(IMON) R33.1 ; port IMON
OVP: IC5.5(OVP) R34.2 R35.1
UVLO: IC5.3(UVLO) R31.2 R34.1
Net24V_1: 24V.1(K) R37.1

Not connected (* = marked no-connect by the designer): IC5 4(NC_1) 7(~{SHDN}) 13(NC_2)

### Notes on the sheet
- Designed for 2A

### Library data of the parts
24V = 156120VS75000: LED; Manufacturer_Name: Wurth Elektronik; Datasheet Link: https://www.we-online.com/components/products/datasheet/156120VS75000.pdf; Height: 1.3mm; Manufacturer_Part_Number: 156120VS75000; Mouser Part Number: 710-156120VS75000; Mouser Price/Stock: https://www.mouser.co.uk/ProductDetail/Wurth-Elektronik/156120VS75000?qs=2kOmHSv6VfQAUFg5BeuEfQ%3D%3D
C37 = KAF31ER71H474KL: Capacitor; Manufacturer_Name: Kyocera AVX; Datasheet Link: https://datasheets.kyocera-avx.com/AutoMLCCKAF.pdf; Height: 1.52mm; Manufacturer_Part_Number: KAF31ER71H474KL; Mouser Part Number: 581-KAF31ER71H474KL; Mouser Price/Stock: https://www.mouser.co.uk/ProductDetail/KYOCERA-AVX/KAF31ER71H474KL?qs=Jm2GQyTW%2FbjNZ75fHRRUJA%3D%3D; Arrow Part Number: KAF31ER71H474KL; Arrow Price/Stock: https://www.arrow.com/en/products/kaf31er71h474kl/avx?region=nac
C38 = KGF31GR72A105KU: Capacitor; Manufacturer_Name: Kyocera AVX; Datasheet Link: https://spicat.kyocera-avx.com/datasheet/KGF31GR72A105KU; Height: 1.78mm; Manufacturer_Part_Number: KGF31GR72A105KU; Mouser Part Number: 581-KGF31GR72A105KU; Mouser Price/Stock: https://www.mouser.co.uk/ProductDetail/KYOCERA-AVX/KGF31GR72A105KU?qs=Jm2GQyTW%2Fbi7xkmery9bvA%3D%3D; Arrow Part Number: KGF31GR72A105KU; Arrow Price/Stock: https://www.arrow.com/en/products/kgf31gr72a105ku/avx?utm_currency=USD&region=nac
IC5 = TPS26600PWPR: Integrated Circuit; Manufacturer_Name: Texas Instruments; Datasheet Link: http://www.ti.com/lit/gpn/tps2660; Height: 1.2mm; Manufacturer_Part_Number: TPS26600PWPR; Mouser Part Number: 595-TPS26600PWPR; Mouser Price/Stock: https://www.mouser.co.uk/ProductDetail/Texas-Instruments/TPS26600PWPR?qs=Bho%2FbeBaDExFVQBFO8fB%2FQ%3D%3D; Arrow Part Number: TPS26600PWPR; Arrow Price/Stock: https://www.arrow.com/en/products/tps26600pwpr/texas-instruments?region=nac
R30 = MCA1206ME1003BP500: Resistor; Manufacturer_Name: Vishay; Datasheet Link: https://www.vishay.com/docs/28700/mcx0x0xpre.pdf; Height: 0.65mm; Manufacturer_Part_Number: MCA1206ME1003BP500
R31 = ERA-8AEB7153V: Resistor; Manufacturer_Name: Panasonic; Datasheet Link: https://industrial.panasonic.com/cdbs/www-data/pdf/RDM0000/AOA0000C307.pdf; Height: 0.7mm; Manufacturer_Part_Number: ERA-8AEB7153V; Mouser Part Number: 667-ERA-8AEB7153V; Mouser Price/Stock: https://www.mouser.co.uk/ProductDetail/Panasonic/ERA-8AEB7153V?qs=MNPzkKEzRtQwT%2F%2F5AstjZA%3D%3D; Arrow Part Number: ERA-8AEB7153V; Arrow Price/Stock: https://www.arrow.com/en/products/era-8aeb7153v/panasonic
R32 = ERA-8AEB6041V: Resistor; Manufacturer_Name: Panasonic; Datasheet Link: https://industrial.panasonic.com/cdbs/www-data/pdf/RDM0000/AOA0000C307.pdf; Height: 0.7mm; Manufacturer_Part_Number: ERA-8AEB6041V
R33 = ERA-8AEB2102V: Resistor; Manufacturer_Name: Panasonic; Datasheet Link: https://industrial.panasonic.com/cdbs/www-data/pdf/RDM0000/AOA0000C307.pdf; Height: 0.7mm; Manufacturer_Part_Number: ERA-8AEB2102V; Mouser Part Number: 667-ERA-8AEB2102V; Mouser Price/Stock: https://www.mouser.co.uk/ProductDetail/Panasonic/ERA-8AEB2102V?qs=MNPzkKEzRtSGOL2oFTGtSQ%3D%3D
R34 = ERA-8ARB203V: Resistor; Manufacturer_Name: Panasonic; Datasheet Link: https://industrial.panasonic.com/cdbs/www-data/pdf/RDM0000/AOA0000C307.pdf; Height: 0.7mm; Manufacturer_Part_Number: ERA-8ARB203V; Mouser Part Number: 667-ERA-8ARB203V; Mouser Price/Stock: https://www.mouser.co.uk/ProductDetail/Panasonic/ERA-8ARB203V?qs=6%252Bc%252B2ke79U6sTVaKLKhC4g%3D%3D
R35 = ERA-8AEB3012V: Resistor; Manufacturer_Name: Panasonic; Datasheet Link: https://industrial.panasonic.com/cdbs/www-data/pdf/RDM0000/AOA0000C307.pdf; Height: 0.7mm; Manufacturer_Part_Number: ERA-8AEB3012V; Mouser Part Number: 667-ERA-8AEB3012V; Mouser Price/Stock: https://www.mouser.co.uk/ProductDetail/Panasonic/ERA-8AEB3012V?qs=MNPzkKEzRtRrrEBjINaeEw%3D%3D; Arrow Part Number: ERA-8AEB3012V; Arrow Price/Stock: https://www.arrow.com/en/products/era-8aeb3012v/panasonic
R37 = CRGS1206J1K0: as R14 on sheet LED_Driver; Datasheet Link: https://www.te.com/commerce/DocumentDelivery/DDEController?Action=srchrtrv&DocNm=9-1773463-8&DocType=Data%20Sheet&DocLang=English&PartCntxt=3-2176245-7&DocFormat=pdf; Height: 0.65mm; Manufacturer_Part_Number: CRGS1206J1K0; Mouser Part Number: 279-CRGS1206J1K0; Mouser Price/Stock: https://www.mouser.com/Search/Refine.aspx?Keyword=279-CRGS1206J1K0

## Sheet 24V_Buck_3_3V.SchDoc
size A; SheetNumber: 9; SheetTotal: 10
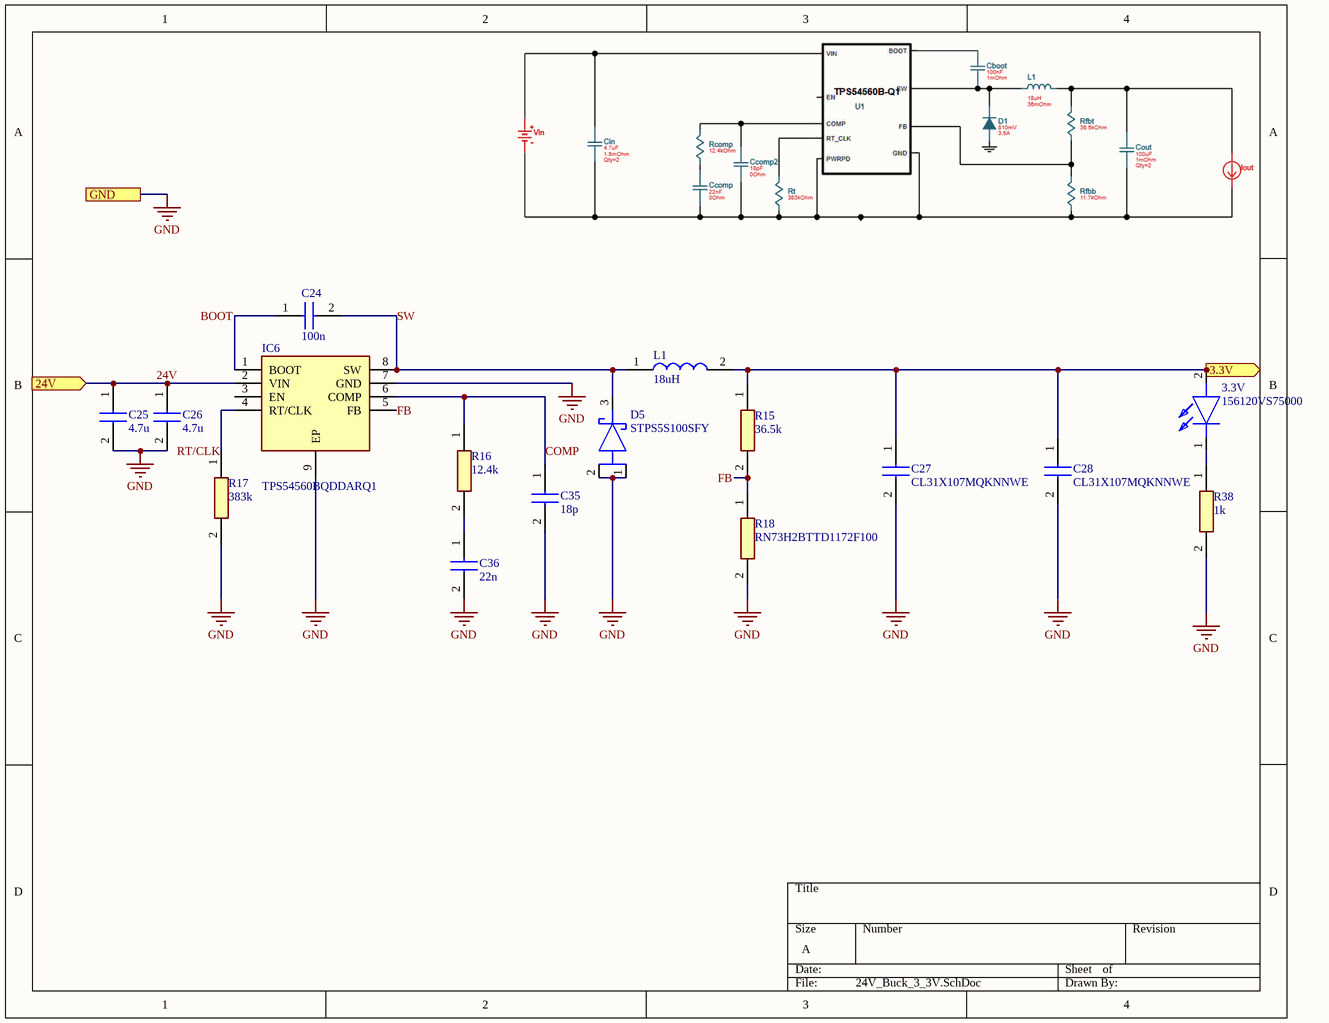
[diagram p9: 24V_Buck_3_3V.SchDoc]

### Parts
3.3V  156120VS75000  [156120VS75000]
C24  100n  [CAPC3216X94N]
C25  4.7u  [CAPC3216X180N]
C26  4.7u  [CAPC3216X180N]
C27  CL31X107MQKNNWE  [CAPC3216X190N]
C28  CL31X107MQKNNWE  [CAPC3216X190N]
C35  18p  [C1206]
C36  22n  [CAPC3216X170N]
D5  STPS5S100SFY  [STPS10L40CSF]
IC6  TPS54560BQDDARQ1  [SOIC127P600X170-9N]
L1  18uH  [INDPM125125X800N]
R15  36.5k  [RESC3116X65N]
R16  12.4k  [ERJUP6]
R17  383k  [RESC3216X70N]
R18  RN73H2BTTD1172F100  [RESC3216X70N]
R38  1k  [RESC3116X65N]

### Ports
3.3V (out), 24V (in), GND

### Nets
GND: C25.2 C26.2 C27.2 C28.2 C35.2 C36.2 D5.1(A1) D5.2(A2) IC6.7(GND) IC6.9(EP) R17.2 R18.2 R38.2 ; port GND
3.3V: 3.3V.2(A) C27.1 C28.1 L1.2 R15.1 ; port 3.3V
24V: C25.1 C26.1 IC6.2(VIN) ; port 24V
BOOT: C24.1 IC6.1(BOOT)
COMP: C35.1 IC6.6(COMP) R16.1
FB: IC6.5(FB) R15.2 R18.1
RT/CLK: IC6.4(RT/CLK) R17.1
SW: C24.2 D5.3(K) IC6.8(SW) L1.1
Net3.3V_1: 3.3V.1(K) R38.1
NetC36_1: C36.1 R16.2

Not connected (* = marked no-connect by the designer): IC6 3(EN)

### Library data of the parts
3.3V = 156120VS75000: LED; Manufacturer_Name: Wurth Elektronik; Datasheet Link: https://www.we-online.com/components/products/datasheet/156120VS75000.pdf; Height: 1.3mm; Manufacturer_Part_Number: 156120VS75000; Mouser Part Number: 710-156120VS75000; Mouser Price/Stock: https://www.mouser.co.uk/ProductDetail/Wurth-Elektronik/156120VS75000?qs=2kOmHSv6VfQAUFg5BeuEfQ%3D%3D
C24 = 12065C104J4Z2A: as C4 on sheet STM32; Datasheet Link: https://spicat.kyocera-avx.com/product/mlcc/chartview/12065C104J4Z2A/DataSheet/X7R; Height: 0.94mm; Manufacturer_Part_Number: 12065C104J4Z2A; Mouser Part Number: 581-12065C104J4Z2A; Mouser Price/Stock: https://www.mouser.com/Search/Refine.aspx?Keyword=581-12065C104J4Z2A
C25 C26 = GMK316AB7475KLHT: as C3 on sheet STM32; Datasheet Link: https://ds.yuden.co.jp/TYCOMPAS/ap/specSheet?pn=MMASG31LAB7475KTNA01; Height: 1.8mm; Manufacturer_Part_Number: GMK316AB7475KLHT; Mouser Part Number: 963-GMK316AB7475KLHT; Mouser Price/Stock: https://www.mouser.co.uk/ProductDetail/TAIYO-YUDEN/GMK316AB7475KLHT?qs=CNQs48zzdnoeKLJ9%2F6WNWQ%3D%3D; Arrow Part Number: GMK316AB7475KLHT; Arrow Price/Stock: https://www.arrow.com/en/products/gmk316ab7475klht/taiyo-yuden?utm_currency=USD&region=nac
C27 C28 = CL31X107MQKNNWE: Capacitor; Manufacturer_Name: SAMSUNG; Datasheet Link: https://www.digikey.sg/en/products/detail/samsung-electro-mechanics/CL31X107MQKNNWE/25854287?srsltid=AfmBOoqYZ52GRQ9Xlh8bi0lGOe-KtDJ1wz9-WyaigKcCVSEueXc8l4on; Height: 1.9mm; Manufacturer_Part_Number: CL31X107MQKNNWE; Mouser Part Number: 187-CL31X107MQKNNWE; Mouser Price/Stock: https://www.mouser.co.uk/ProductDetail/Samsung-Electro-Mechanics/CL31X107MQKNNWE?qs=Jm2GQyTW%2FbjTv%252BH%2F%252BndEuA%3D%3D
C35 = C1206C180FGGACTU: Capacitor; Manufacturer_Name: KEMET; Datasheet Link: https://content.kemet.com/datasheets/KEM_C1009_C0G_HV_SMD.pdf; Manufacturer_Part_Number: C1206C180FGGACTU
C36 = VJ1206Y223KXBAC: Capacitor; Manufacturer_Name: Vishay; Datasheet Link: http://www.vishay.com/docs/45200/vjhirelseries.pdf; Height: 1.7mm; Manufacturer_Part_Number: VJ1206Y223KXBAC; Mouser Part Number: 77-VJ1206Y223KXBAC; Mouser Price/Stock: https://www.mouser.co.uk/ProductDetail/Vishay-Vitramon/VJ1206Y223KXBAC?qs=DS7Z8uEdLNy5V8LiZ3YDHg%3D%3D
D5 = STPS5S100SFY: Schottky Diode with Dual Anode; Manufacturer_Name: STMicroelectronics; Datasheet Link: https://www.st.com/resource/en/datasheet/stps5s100sfy.pdf; Height: 1.2mm; Manufacturer_Part_Number: STPS5S100SFY; Mouser Part Number: 511-STPS5S100SFY; Mouser Price/Stock: https://www.mouser.co.uk/ProductDetail/STMicroelectronics/STPS5S100SFY?qs=IS%252B4QmGtzzqXirfVtJ7lSA%3D%3D
IC6 = TPS54560BQDDARQ1: Integrated Circuit; Manufacturer_Name: Texas Instruments; Datasheet Link: http://www.ti.com/lit/gpn/tps54560b-q1; Height: 1.7mm; Manufacturer_Part_Number: TPS54560BQDDARQ1; Mouser Part Number: 595-TPS54560BQDDARQ1; Mouser Price/Stock: https://www.mouser.co.uk/ProductDetail/Texas-Instruments/TPS54560BQDDARQ1?qs=Mv7BduZupUi0AsDfghsxzg%3D%3D; Arrow Part Number: TPS54560BQDDARQ1; Arrow Price/Stock: https://www.arrow.com/en/products/tps54560bqddarq1/texas-instruments?utm_currency=USD&region=nac
L1 = SRR1280-180M: Inductor; Manufacturer_Name: Bourns; Datasheet Link: https://www.bourns.com/docs/Product-Datasheets/SRR1280.pdf; Height: 8mm; Manufacturer_Part_Number: SRR1280-180M; Mouser Part Number: 652-SRR1280-180M; Mouser Price/Stock: https://www.mouser.co.uk/ProductDetail/Bourns/SRR1280-180M?qs=brMhP%2FMjUfeRcSm%2FRxSrFQ%3D%3D; Arrow Part Number: SRR1280-180M; Arrow Price/Stock: https://www.arrow.com/en/products/srr1280-180m/bourns?region=nac
R15 = CRCW120636K5FKEAHP: Resistor; Manufacturer_Name: Vishay; Height: 0.65mm; Manufacturer_Part_Number: CRCW120636K5FKEAHP; Mouser Part Number: 71-CRCW120636K5FKEAH; Mouser Price/Stock: https://www.mouser.co.uk/ProductDetail/Vishay-Dale/CRCW120636K5FKEAHP?qs=VAB4DzKv5wUp%2FbasZHay7w%3D%3D; Arrow Part Number: CRCW120636K5FKEAHP; Arrow Price/Stock: https://www.arrow.com/en/products/crcw120636k5fkeahp/vishay?region=nac
R16 = ERJ-UP6F1242V: Resistor; Manufacturer_Name: Panasonic; Datasheet Link: https://industrial.panasonic.com/cdbs/www-data/pdf/RDP0000/AOA0000C337.pdf; Height: 0.7mm; Manufacturer_Part_Number: ERJ-UP6F1242V; Mouser Part Number: 667-ERJ-UP6F1242V; Mouser Price/Stock: https://www.mouser.co.uk/ProductDetail/Panasonic/ERJ-UP6F1242V?qs=dbcCsuKDzFVg0bvXpJGfbQ%3D%3D
R17 = ERA-8AEB3833V: Resistor; Manufacturer_Name: Panasonic; Datasheet Link: https://industrial.panasonic.com/cdbs/www-data/pdf/RDM0000/AOA0000C307.pdf; Height: 0.7mm; Manufacturer_Part_Number: ERA-8AEB3833V
R18 = RN73H2BTTD1172F100: Resistor; Manufacturer_Name: KOA Speer; Datasheet Link: https://www.koaspeer.com/pdfs/RN73H.pdf; Height: 0.7mm; Manufacturer_Part_Number: RN73H2BTTD1172F100; Mouser Part Number: 660-RN73H2BT1172F100; Mouser Price/Stock: https://www.mouser.co.uk/ProductDetail/KOA-Speer/RN73H2BTTD1172F100?qs=egkD4cx1ihS0KaGLrT%2FVSQ%3D%3D
R38 = CRGS1206J1K0: as R14 on sheet LED_Driver; Datasheet Link: https://www.te.com/commerce/DocumentDelivery/DDEController?Action=srchrtrv&DocNm=9-1773463-8&DocType=Data%20Sheet&DocLang=English&PartCntxt=3-2176245-7&DocFormat=pdf; Height: 0.65mm; Manufacturer_Part_Number: CRGS1206J1K0; Mouser Part Number: 279-CRGS1206J1K0; Mouser Price/Stock: https://www.mouser.com/Search/Refine.aspx?Keyword=279-CRGS1206J1K0

## Sheet CAN.SchDoc
size A
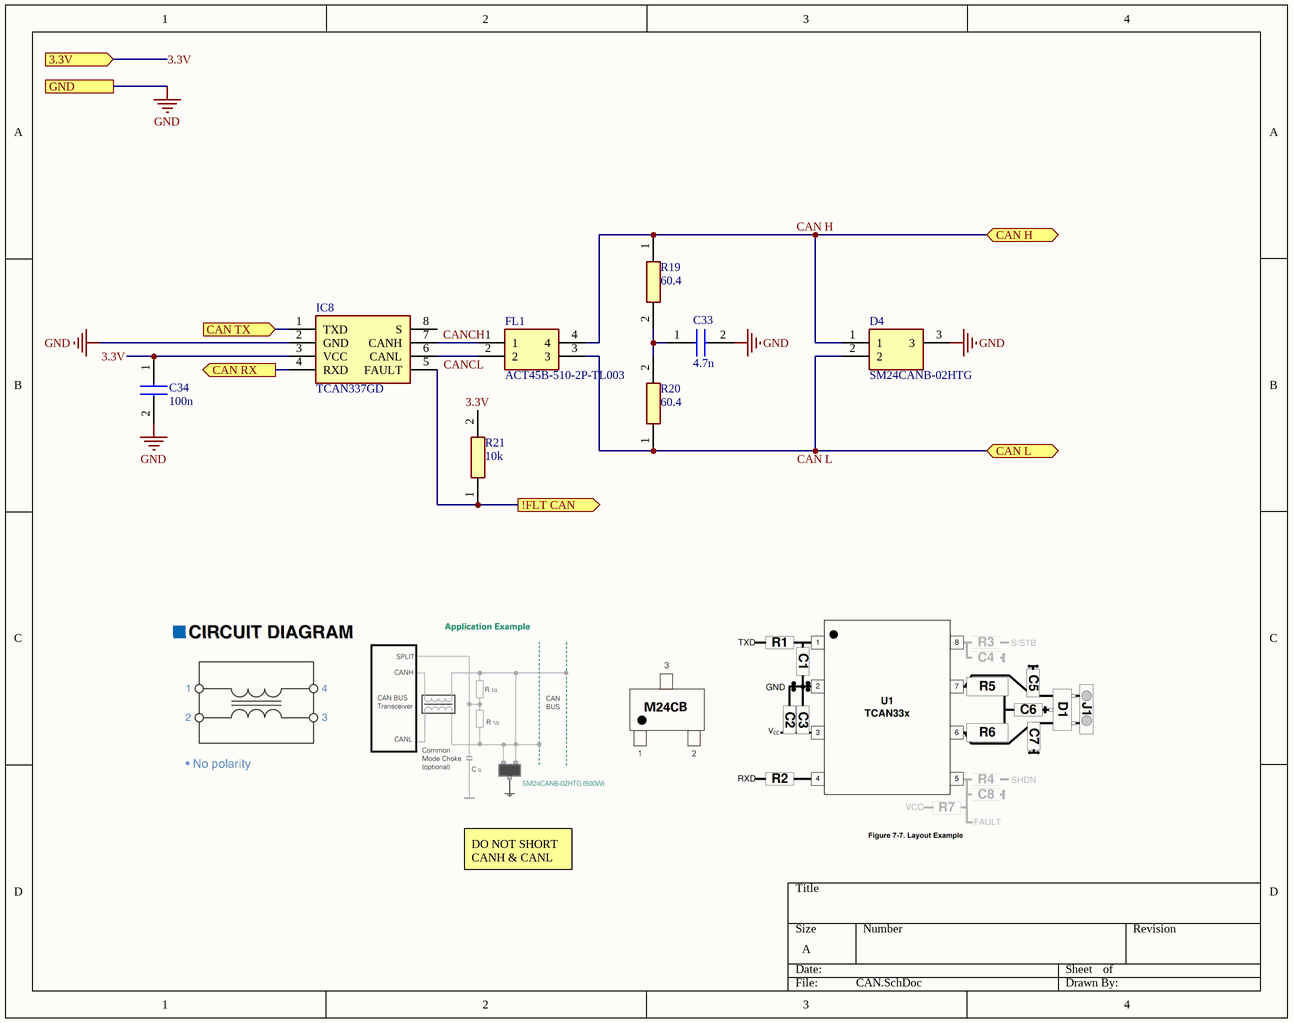
[diagram p10: CAN.SchDoc]

### Parts
C33  4.7n  [CAPC3216X75N]
C34  100n  [CAPC3216X94N]
D4  SM24CANB-02HTG  [SM24CANB02HTG]
FL1  ACT45B-510-2P-TL003  [ACT45B1012PTL003]
IC8  TCAN337GD  [SOIC127P600X175-8N]
R19  60.4  [RESC3216X65N]
R20  60.4  [RESC3216X65N]
R21  10k  [RESC3216X65N]

### Ports
3.3V (in), !FLT CAN (out), CAN H (bidir), CAN L (bidir), CAN RX (out), CAN TX (in), GND

### Nets
GND: C33.2 C34.2 D4.3 IC8.2(GND) ; port GND
3.3V: C34.1 IC8.3(VCC) R21.2 ; port 3.3V
!FLT CAN: IC8.5(FAULT) R21.1 ; port !FLT CAN
CAN H: D4.1 FL1.4 R19.1 ; port CAN H
CAN L: D4.2 FL1.3 R20.1 ; port CAN L
CAN RX: IC8.4(RXD) ; port CAN RX
CAN TX: IC8.1(TXD) ; port CAN TX
CANCH: FL1.1 IC8.7(CANH)
CANCL: FL1.2 IC8.6(CANL)
NetC33_1: C33.1 R19.2 R20.2

Not connected (* = marked no-connect by the designer): IC8 8(S)

### Notes on the sheet
- DO NOT SHORT CANH & CANL

### Library data of the parts
C33 = KAM31GR71H475KL: Capacitor; Manufacturer_Name: Kyocera AVX; Datasheet Link: https://www.mouser.jp/datasheet/2/40/AutoMLCCKAM-3216307.pdf; Height: 0.75mm; Manufacturer_Part_Number: KAM31GR71H475KL; Mouser Part Number: 581-KAM31GR71H475KL; Mouser Price/Stock: https://www.mouser.co.uk/ProductDetail/KYOCERA-AVX/KAM31GR71H475KL?qs=Jm2GQyTW%2FbjSbY1tCxiE1g%3D%3D
C34 = 12065C104J4Z2A: as C4 on sheet STM32; Datasheet Link: https://spicat.kyocera-avx.com/product/mlcc/chartview/12065C104J4Z2A/DataSheet/X7R; Height: 0.94mm; Manufacturer_Part_Number: 12065C104J4Z2A; Mouser Part Number: 581-12065C104J4Z2A; Mouser Price/Stock: https://www.mouser.com/Search/Refine.aspx?Keyword=581-12065C104J4Z2A
D4 = SM24CANB-02HTG: TVS Diode (Bi-directional); Manufacturer_Name: LITTELFUSE; Datasheet Link: https://www.littelfuse.com/products/overvoltage-protection/tvs-diode-arrays/general-purpose/sm24canb/sm24canb-02htg; Height: 1.12mm; Manufacturer_Part_Number: SM24CANB-02HTG; Mouser Part Number: 576-SM24CANB-02HTG; Mouser Price/Stock: https://www.mouser.co.uk/ProductDetail/Littelfuse/SM24CANB-02HTG?qs=bWsWnctWn1wbKmCYlcUmHw%3D%3D; Arrow Part Number: SM24CANB-02HTG; Arrow Price/Stock: https://www.arrow.com/en/products/sm24canb-02htg/littelfuse?utm_currency=USD&region=nac
FL1 = ACT45B-510-2P-TL003: Filter; Manufacturer_Name: TDK; Datasheet Link: https://product.tdk.com/system/files/dam/doc/product/emc/emc/cmf_cmc/catalog/cmf_automotive_signal_act45b_en.pdf; Height: 3mm; Manufacturer_Part_Number: ACT45B-510-2P-TL003; Mouser Part Number: 810-ACT45B5102PTL003; Mouser Price/Stock: https://www.mouser.co.uk/ProductDetail/TDK/ACT45B-510-2P-TL003?qs=U1cgCdF9Le9LCroNYLqljw%3D%3D; Arrow Part Number: ACT45B-510-2P-TL003; Arrow Price/Stock: https://www.arrow.com/en/products/act45b-510-2p-tl003/tdk?utm_currency=USD&region=nac
IC8 = TCAN337GD: Integrated Circuit; Manufacturer_Name: Texas Instruments; Datasheet Link: https://www.arrow.com/en/products/tcan337gd/texas-instruments; Height: 1.75mm; Manufacturer_Part_Number: TCAN337GD; Mouser Part Number: 595-TCAN337GD; Mouser Price/Stock: https://www.mouser.co.uk/ProductDetail/Texas-Instruments/TCAN337GD?qs=gMfM3zrbS4qmjQESf%252BTgJw%3D%3D; Arrow Part Number: TCAN337GD; Arrow Price/Stock: https://www.arrow.com/en/products/tcan337gd/texas-instruments?region=europe
R19 R20 = ESR18EZPF60R4: Resistor; Manufacturer_Name: ROHM Semiconductor; Datasheet Link: https://datasheet.datasheetarchive.com/originals/dk/DKDS-18/356400.pdf; Height: 0.65mm; Manufacturer_Part_Number: ESR18EZPF60R4
R21 = SFR18EZPJ103: as R39 on sheet STM32; Datasheet Link: https://fscdn.rohm.com/en/products/databook/datasheet/passive/resistor/chip_resistor/sfr-e.pdf; Height: 0.65mm; Manufacturer_Part_Number: SFR18EZPJ103

## Nets that join several sheets
GND: Relay_Control (6 pins), Connectors (7 pins), LEDs/+ (IC4_+.2), LEDs/- (IC4_-.2), LEDs/PC (IC4_PC.2), LEDs/HB (IC4_HB.2), LEDs/SLR (IC4_SLR.2), Precharge_Fail (IC9.2), STM32 (27 pins), VoltageSense (C2.2 IC2.4), eFuse (10 pins), 24V_Buck_3_3V (13 pins), CAN (C33.2 C34.2 D4.3 IC8.2)
3.3V: Connectors (J2.3 J9.3), STM32 (25 pins), VoltageSense (C2.1 IC2.1 R28.1 R29.1), 24V_Buck_3_3V (5 pins), CAN (C34.1 IC8.3 R21.2)
24V: LEDs/+ (LED_+.2), LEDs/- (LED_-.2), LEDs/PC (LED_PC.2), LEDs/HB (LED_HB.2), LEDs/SLR (LED_SLR.2), Precharge_Fail (PC_FAIL.2), eFuse (24V.2 IC5.15 IC5.16 R30.1), 24V_Buck_3_3V (C25.1 C26.1 IC6.2)
24V Unfused: Connectors (J1.1), eFuse (C38.1 IC5.1 IC5.2 R31.1)
!FLT CAN: STM32 (IC3.43), CAN (IC8.5 R21.1)
+ Relay GND: Relay_Control (D1.2 M1.3), Connectors (J4.1)
+ Signal: Relay_Control (M1.1 R42.1), LEDs/+ (IC4_+.1), STM32 (IC3.33)
- Relay GND: Relay_Control (D2.2 M2.3), Connectors (J6.1)
- Signal: Relay_Control (M2.1 R43.1), LEDs/- (IC4_-.1), STM32 (IC3.35)
CAN H: Connectors (J10.2), CAN (D4.1 FL1.4 R19.1)
CAN L: Connectors (J10.1), CAN (D4.2 FL1.3 R20.1)
CAN RX: STM32 (IC3.44), CAN (IC8.4)
CAN TX: STM32 (IC3.45), CAN (IC8.1)
Heartbeat: LEDs/HB (IC4_HB.1), STM32 (IC3.16)
HV+ BAT: Relay_Control (K1.1), Connectors (J3.1 J3.2), VoltageSense (F3.1)
HV+ MC Unfused: Relay_Control (R13.2 R13.3), Connectors (J5.1 J5.2), VoltageSense (F2.1)
HV- MC Unfused: Connectors (J8.1 J8.2), VoltageSense (F1.1)
IMON: STM32 (IC3.41), eFuse (IC5.10 R33.1)
NetIC3_21: Connectors (J11.1), STM32 (IC3.21)
NetIC3_23: Connectors (J11.2), STM32 (IC3.23)
NetIC3_25: Connectors (J11.3), STM32 (IC3.25)
NetIC3_27: Connectors (J11.4), STM32 (IC3.27)
NRST: Connectors (J9.12), STM32 (C21.1 IC3.7 S1.1 S1.3)
PC Signal: Relay_Control (M3.1 R44.1), LEDs/PC (IC4_PC.1), STM32 (IC3.37)
PC_Enable: Connectors (J2.4), STM32 (R39.1 R40.1)
PC_Fail: Precharge_Fail (IC9.1), STM32 (IC3.51)
Precharge Relay GND: Relay_Control (D3.2 K1.4 M3.3), Connectors (J7.1)
SCL: STM32 (R8.1), VoltageSense (IC2.3 R29.2)
SDA: STM32 (R7.1), VoltageSense (IC2.2 R28.2)
SL_Ready: Relay_Control (D1.1 D2.1 D3.1 K1.3), Connectors (J4.2 J6.2 J7.2 J12.1), LEDs/SLR (IC4_SLR.1)
SWCLK: Connectors (J9.6), STM32 (IC3.49)
SWDIO: Connectors (J9.4), STM32 (IC3.46)
SWO: Connectors (J9.8), STM32 (IC3.55)